# EAGLE design CUAVA_HSI_controller (EAGLE 9.5.2)

## Sheet 1 of 2: HSI Motherboard
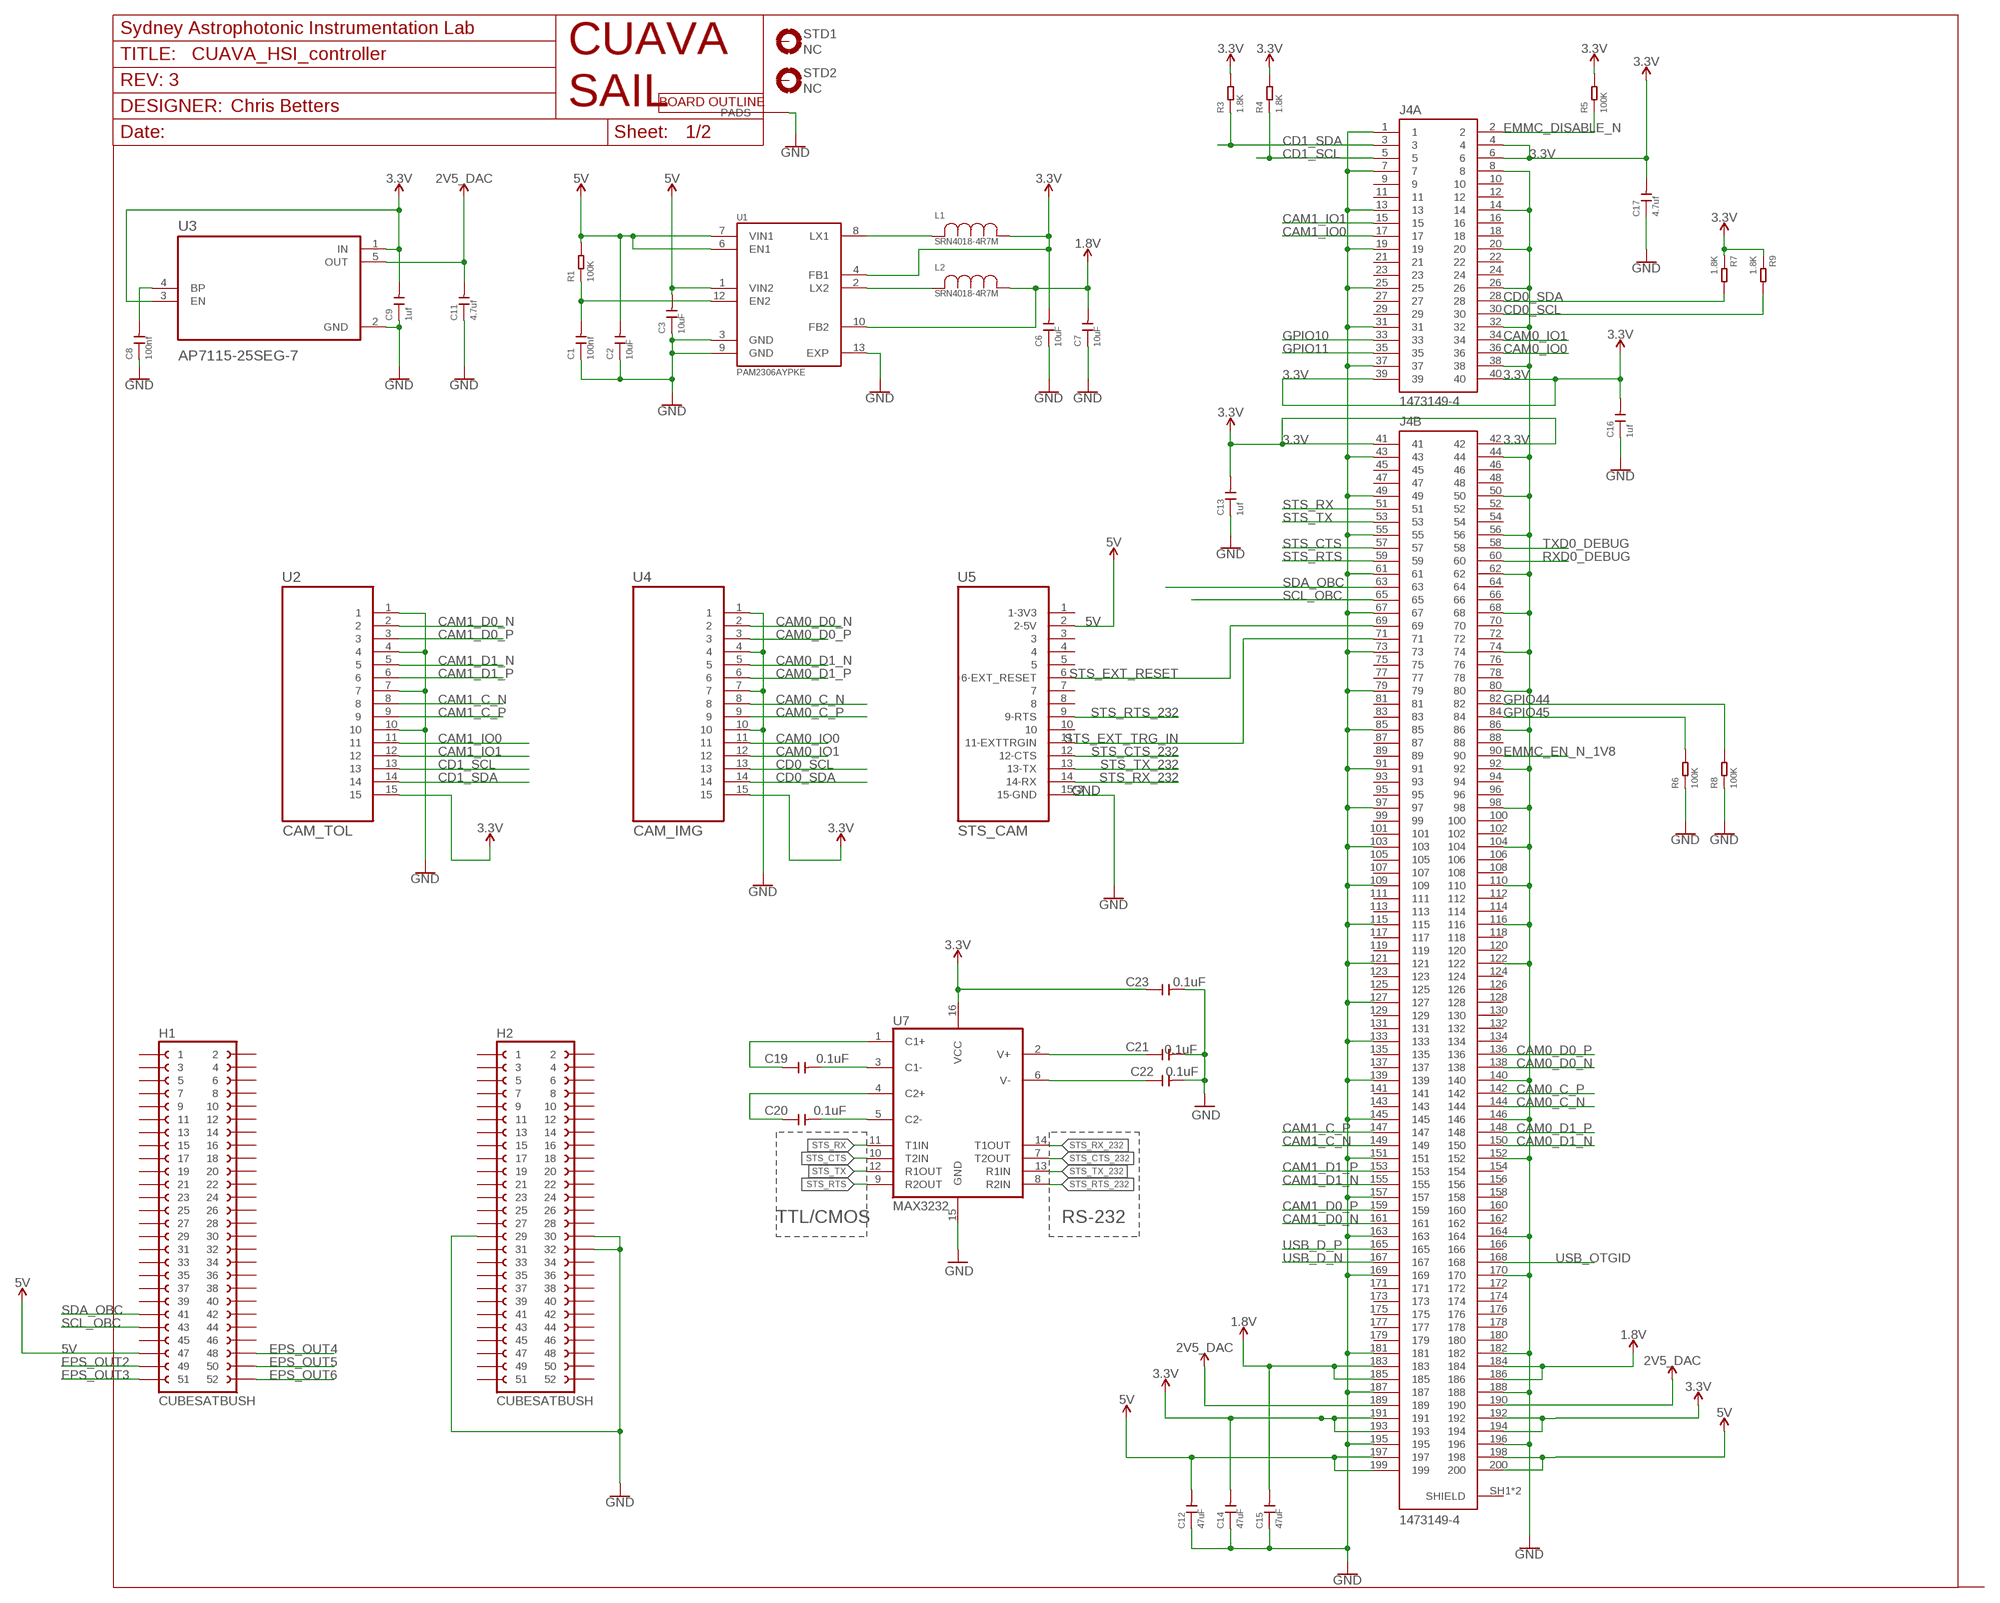
[diagram p0: schematic, sheet 1]

### Parts
C1  100nf  CERAMIC-100NF-25V-10%-X7R(0402)  [C0402K]
C2  10uF  CERAMIC-10UF-(1206)  [C3216]
C3  10uF  CERAMIC-10UF-(1206)  [C3216]
C6  10uF  CERAMIC-10UF-(1206)  [C3216]
C7  10uF  CERAMIC-10UF-(1206)  [C3216]
C8  100nf  CERAMIC-100NF-25V-10%-X7R(0402)  [C0402K]
C9  1uf  CERAMIC-1UF-10V-10%-X5R(0402)  [C0402K]
C11  4.7uf  CERAMIC-4.7UF-10V-10%-X5R(0603)  [C0603]
C12  47uF  CERAMIC-47UF-6.3V-20%-(1206)  [C3216]
C13  1uf  CERAMIC-1UF-10V-10%-X5R(0402)  [C0402K]
C14  47uF  CERAMIC-47UF-6.3V-20%-(1206)  [C3216]
C15  47uF  CERAMIC-47UF-6.3V-20%-(1206)  [C3216]
C16  1uf  CERAMIC-1UF-10V-10%-X5R(0402)  [C0402K]
C17  4.7uf  CERAMIC-4.7UF-10V-10%-X5R(0603)  [C0603]
C19  0.1uF  CERAMIC-0.1UF-16V-10%-X5R(0402)  [C0402K]
C20  0.1uF  CERAMIC-0.1UF-16V-10%-X5R(0402)  [C0402K]
C21  0.1uF  CERAMIC-0.1UF-16V-10%-X5R(0402)  [C0402K]
C22  0.1uF  CERAMIC-0.1UF-16V-10%-X5R(0402)  [C0402K]
C23  0.1uF  CERAMIC-0.1UF-16V-10%-X5R(0402)  [C0402K]
EDGE1  CUBESAT_BOARD_OUTLINE  [CUBESAT_BOARD_OUTLINE]
FRAME1  SAIL_FRAMEDEFAULT  [SAIL_FRAME_DEFAULT]
H1  CUBESATBUSH  [2X26HEADER]
H2  CUBESATBUSH  [2X26HEADER]
J4  1473149-4  [TE_1473149-4]
L1  SRN4018-4R7M  [IND_BOURNS_SRN4018]
L2  SRN4018-4R7M  [IND_BOURNS_SRN4018]
LOGO1  CUAVA_LOGO  [CUAVA_LOGO]
LOGO2  SAIL_LOGO  [SAIL_LOGO_VEC_20MM]
R1  100K  SMD-RES-100K-1%-1/16W(0402)  [R0402]
R3  1.8K  SMD-RES-1.8K-1%-1/16W(0402)  [R0402]
R4  1.8K  SMD-RES-1.8K-1%-1/16W(0402)  [R0402]
R5  100K  SMD-RES-100K-1%-1/16W(0402)  [R0402]
R6  100K  SMD-RES-100K-1%-1/16W(0402)  [R0402]
R7  1.8K  SMD-RES-1.8K-1%-1/16W(0402)  [R0402]
R8  100K  SMD-RES-100K-1%-1/16W(0402)  [R0402]
R9  1.8K  SMD-RES-1.8K-1%-1/16W(0402)  [R0402]
STD1  NC  9774030243  [3,0-PAD]
STD2  NC  9774030243  [3,0-PAD]
U1  PAM2306AYPKE  [SON45P300X300X80-13N]
U2  CAM_TOL  10051922-1510ELF  [FCI_10051922-1510ELF]
U3  AP7115-25SEG-7  [SOT65P210X110-5N]
U4  CAM_IMG  10051922-1510ELF  [FCI_10051922-1510ELF]
U5  STS_CAM  STS-10051922-1510ELF  [FCI_10051922-1510ELF]
U7  MAX3232  MAX232TSSOP  [TSSOP16]

### Nets
1.8V [pwr]: C7.2 C15.2 J4.183 J4.184 J4.185 J4.186 L2.1 U1.10(FB2)
2V5 [pwr]: C11.2 J4.189 J4.190 U3.5(OUT) ; supply symbol labelled 2V5_DAC
3.3V [pwr]: C6.2 C9.2 C13.2 C14.2 C16.2 C17.2 C23.1 J4.4 J4.6 J4.39 J4.40 J4.41 J4.42 J4.191 J4.192 J4.193 J4.194 L1.1 R3.2 R4.2 R5.2 R7.1 R9.1 U1.4(FB1) U2.15 U3.1(IN) U3.3(EN) U4.15 U7.16(VCC)
5V [pwr]: C2.2 C3.2 C12.2 H1.47 J4.197 J4.198 J4.199 J4.200 R1.2 U1.1(VIN2) U1.6(EN1) U1.7(VIN1) U5.2(2-5V) ; also sheet 2
C1+: C19.1 U7.1(C1+)
C1-: C19.2 U7.3(C1-)
C2+: C20.1 U7.4(C2+)
C2-: C20.2 U7.5(C2-)
CAM0_C_N [diff pairs]: J4.144 U4.8
CAM0_C_P [diff pairs]: J4.142 U4.9
CAM0_D0_N [diff pairs]: J4.138 U4.2
CAM0_D0_P [diff pairs]: J4.136 U4.3
CAM0_D1_N [diff pairs]: J4.150 U4.5
CAM0_D1_P [diff pairs]: J4.148 U4.6
CAM0_IO0: J4.36 U4.11
CAM0_IO1: J4.34 U4.12
CAM1_C_N [diff pairs]: J4.149 U2.8
CAM1_C_P [diff pairs]: J4.147 U2.9
CAM1_D0_N [diff pairs]: J4.161 U2.2
CAM1_D0_P [diff pairs]: J4.159 U2.3
CAM1_D1_N [diff pairs]: J4.155 U2.5
CAM1_D1_P [diff pairs]: J4.153 U2.6
CAM1_IO0: J4.17 U2.11
CAM1_IO1: J4.15 U2.12
CD0_SCL [i2c]: J4.30 R9.2 U4.13
CD0_SDA [i2c]: J4.28 R7.2 U4.14
CD1_SCL [i2c]: J4.5 R4.1 U2.13
CD1_SDA [i2c]: J4.3 R3.1 U2.14
EMMC_DISABLE_N: J4.2 R5.1
EMMC_EN_N_1V8: J4.90
EN2: C1.2 R1.1 U1.12(EN2)
EPS_OUT2 [pwr]: H1.49 ; also sheet 2
EPS_OUT3 [pwr]: H1.51
EPS_OUT4 [pwr]: H1.48 ; also sheet 2
EPS_OUT5 [pwr]: H1.50 ; also sheet 2
EPS_OUT6 [pwr]: H1.52 ; also sheet 2
GND [pwr]: C1.1 C2.1 C3.1 C6.1 C7.1 C8.1 C9.1 C11.1 C12.1 C13.1 C14.1 C15.1 C16.1 C17.1 C21.2 C22.2 C23.2 EDGE1.P$1(PADS) EDGE1.P$2(PADS) EDGE1.P$3(PADS) EDGE1.P$4(PADS) H2.29 H2.30 H2.32 J4.1 J4.7 J4.8 J4.13 J4.14 J4.19 J4.20 J4.25 J4.26 J4.31 J4.32 J4.37 J4.38 J4.43 J4.44 J4.49 J4.50 J4.55 J4.56 J4.61 J4.62 J4.67 J4.68 J4.73 J4.74 J4.79 J4.80 J4.85 J4.86 J4.91 J4.92 J4.97 J4.98 J4.103 J4.104 J4.109 J4.110 J4.115 J4.116 J4.121 J4.122 J4.127 J4.133 J4.139 J4.140 J4.145 J4.146 J4.151 J4.152 J4.157 J4.163 J4.164 J4.169 J4.170 J4.181 J4.182 J4.187 J4.188 J4.195 J4.196 R6.1 R8.1 U1.3(GND) U1.9(GND) U1.13(EXP) U2.1 U2.4 U2.7 U2.10 U3.2(GND) U4.1 U4.4 U4.7 U4.10 U5.15(15-GND) U5.16(15-GND) U5.17(15-GND) U7.15(GND) ; also sheet 2
GPIO10: J4.33
GPIO11: J4.35
GPIO44: J4.82 R8.2
GPIO45: J4.84 R6.2
LX1: L1.2 U1.8(LX1)
LX2: L2.2 U1.2(LX2)
N$6: C8.2 U3.4(BP)
RXD0_DEBUG: J4.60 ; also sheet 2
SCL_OBC [i2c]: H1.43 J4.65 ; also sheet 2
SDA_OBC [i2c]: H1.41 J4.63 ; also sheet 2
STS_CTS: J4.57 U7.10(T2IN)
STS_CTS_232: U5.12(12-CTS) U7.7(T2OUT)
STS_EXT_RESET: J4.69 U5.6(6-EXT_RESET)
STS_EXT_TRG_IN: J4.71 U5.11(11-EXTTRGIN)
STS_RTS: J4.59 U7.9(R2OUT)
STS_RTS_232: U5.9(9-RTS) U7.8(R2IN)
STS_RX: J4.51 U7.11(T1IN)
STS_RX_232: U5.14(14-RX) U7.14(T1OUT)
STS_TX: J4.53 U7.12(R1OUT)
STS_TX_232: U5.13(13-TX) U7.13(R1IN)
TXD0_DEBUG: J4.58 ; also sheet 2
USB_D_N [usb]: J4.167 ; also sheet 2
USB_D_P [usb]: J4.165 ; also sheet 2
USB_OTGID: J4.168
V+: C21.1 U7.2(V+)
V-: C22.1 U7.6(V-)
Unconnected: H1.1 H1.2 H1.3 H1.4 H1.5 H1.6 H1.7 H1.8 H1.9 H1.10 H1.11 H1.12 H1.13 H1.14 H1.15 H1.16 H1.17 H1.18 H1.19 H1.20 H1.21 H1.22 H1.23 H1.24 H1.25 H1.26 H1.27 H1.28 H1.29 H1.30 H1.31 H1.32 H1.33 H1.34 H1.35 H1.36 H1.37 H1.38 H1.39 H1.40 H1.42 H1.44 H1.45 H1.46 H2.1 H2.2 H2.3 H2.4 H2.5 H2.6 H2.7 H2.8 H2.9 H2.10 H2.11 H2.12 H2.13 H2.14 H2.15 H2.16 H2.17 H2.18 H2.19 H2.20 H2.21 H2.22 H2.23 H2.24 H2.25 H2.26 H2.27 H2.28 H2.31 H2.33 H2.34 H2.35 H2.36 H2.37 H2.38 H2.39 H2.40 H2.41 H2.42 H2.43 H2.44 H2.45 H2.46 H2.47 H2.48 H2.49 H2.50 H2.51 H2.52 J4.9 J4.10 J4.11 J4.12 J4.16 J4.18 J4.21 J4.22 J4.23 J4.24 J4.27 J4.29 J4.45 J4.46 J4.47 J4.48 J4.52 J4.54 J4.64 J4.66 J4.70 J4.72 J4.75 J4.76 J4.77 J4.78 J4.81 J4.83 J4.87 J4.88 J4.89 J4.93 J4.94 J4.95 J4.96 J4.99 J4.100 J4.101 J4.102 J4.105 J4.106 J4.107 J4.108 J4.111 J4.112 J4.113 J4.114 J4.117 J4.118 J4.119 J4.120 J4.123 J4.124 J4.125 J4.126 J4.128 J4.129 J4.130 J4.131 J4.132 J4.134 J4.135 J4.137 J4.141 J4.143 J4.154 J4.156 J4.158 J4.160 J4.162 J4.166 J4.171 J4.172 J4.173 J4.174 J4.175 J4.176 J4.177 J4.178 J4.179 J4.180 J4.SH1(B:SHIELD) J4.SH2(B:SHIELD) STD1.B3,0(MOUNT) STD2.B3,0(MOUNT) U5.1(1-3V3) U5.3 U5.4 U5.5 U5.7 U5.8 U5.10

### Notes on the sheet
- TTL/CMOS | RS-232

## Sheet 2 of 2: Power Breakouts from PC/104 header to other systems.
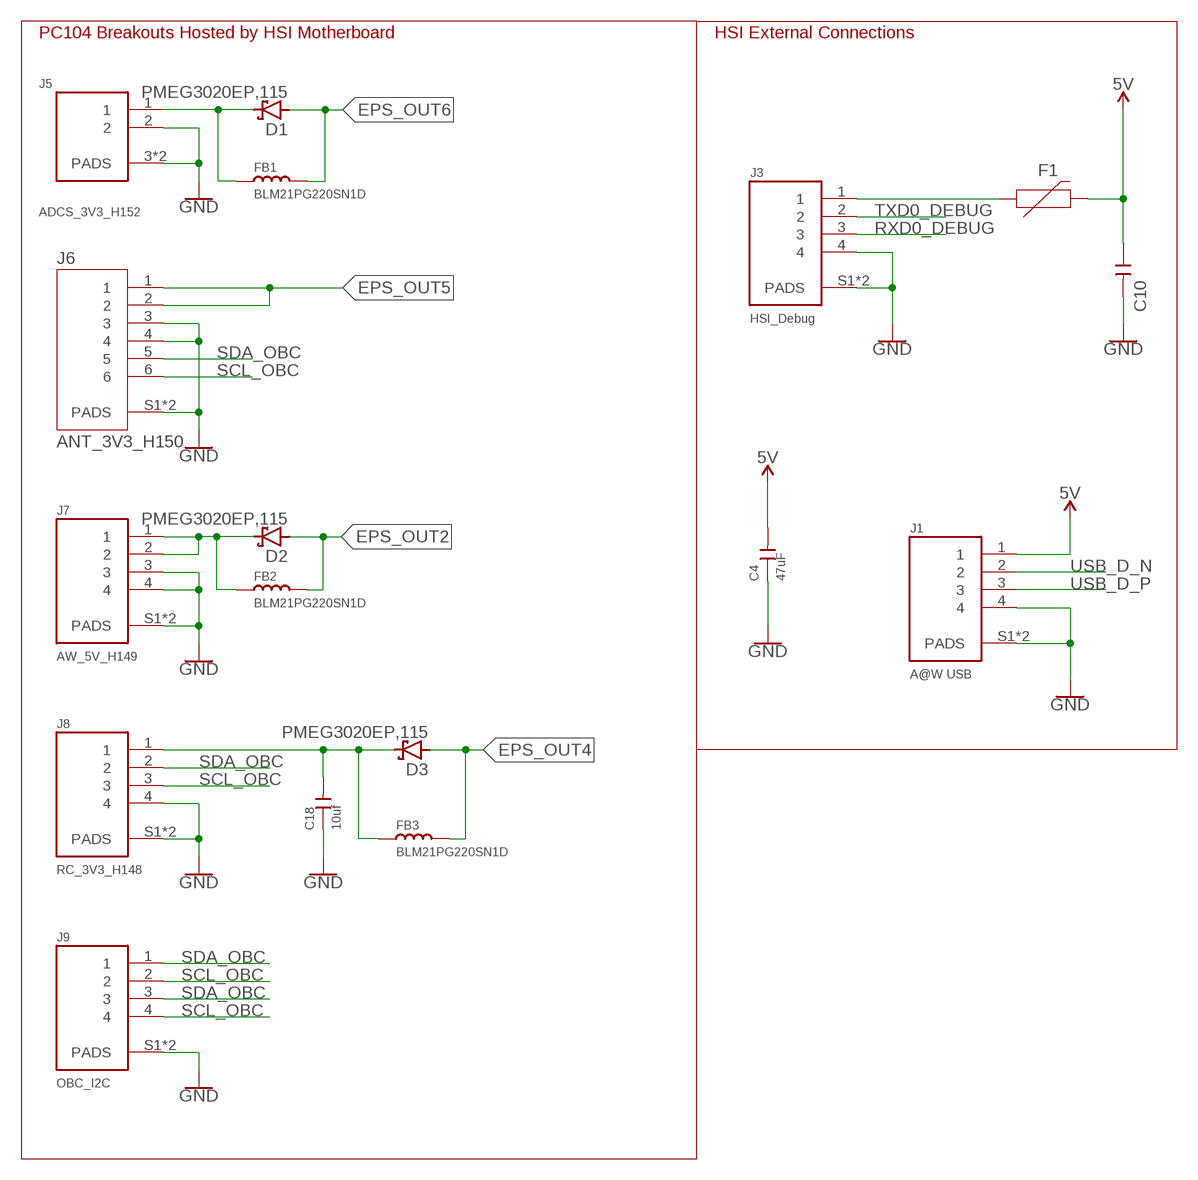
[diagram p1: schematic, sheet 2]

### Parts
C4  47uF  CERAMIC-47UF-6.3V-20%-(1206)  [C3216]
C10  47uF  CERAMIC-47UF-6.3V-20%-(1206)  [C3216]
C18  10uf  TANTALUM-10UF-10V-10%(0805)  [C2012]
D1  PMEG3020EP,115  [SODFL4725X110N]
D2  PMEG3020EP,115  [SODFL4725X110N]
D3  PMEG3020EP,115  [SODFL4725X110N]
F1  MF-MSMF200-2  [FUSM4632X85]
FB1  BLM21PG220SN1D  [C0805]
FB2  BLM21PG220SN1D  [C0805]
FB3  BLM21PG220SN1D  [C0805]
J1  A@W USB  PICOBLADE-4PIN-RIGHTANGLE-SMD  [MOLEX_0532610471]
J3  HSI_Debug  PICOBLADE-4PIN-RIGHTANGLE-SMD  [MOLEX_0532610471]
J5  ADCS_3V3_H152  PICOBLADE-2PIN-RIGHTANGLE-SMD  [MOLEX_0532610271]
J6  ANT_3V3_H150  PICOBLADE-6PIN-RIGHTANGLE-SMD  [MOLEX_0532610671]
J7  AW_5V_H149  PICOBLADE-4PIN-RIGHTANGLE-SMD  [MOLEX_0532610471]
J8  RC_3V3_H148  PICOBLADE-4PIN-RIGHTANGLE-SMD  [MOLEX_0532610471]
J9  OBC_I2C  PICOBLADE-4PIN-RIGHTANGLE-SMD  [MOLEX_0532610471]

### Nets
5V [pwr]: C4.2 C10.1 F1.2 J1.1 ; also sheet 1
A@W_5V0 [pwr]: D2.C FB2.1 J7.1 J7.2
ADCS_3V3 [pwr]: D1.C FB1.1 J5.1
EPS_OUT2 [pwr]: D2.A FB2.2 ; also sheet 1
EPS_OUT4 [pwr]: D3.A FB3.2 ; also sheet 1
EPS_OUT5 [pwr]: J6.1 J6.2 ; also sheet 1
EPS_OUT6 [pwr]: D1.A FB1.2 ; also sheet 1
GND [pwr]: C4.1 C10.2 C18.1 J1.4 J1.S1(PADS) J1.S2(PADS) J3.4 J3.S1(PADS) J3.S2(PADS) J5.2 J5.3(PADS) J5.4(PADS) J6.3 J6.4 J6.S1(PADS) J6.S2(PADS) J7.3 J7.4 J7.S1(PADS) J7.S2(PADS) J8.4 J8.S1(PADS) J8.S2(PADS) J9.S1(PADS) J9.S2(PADS) ; also sheet 1
HSI_DEBUG_V [pwr]: F1.1 J3.1
RC_3V3 [pwr]: C18.2 D3.C FB3.1 J8.1
RXD0_DEBUG: J3.3 ; also sheet 1
SCL_OBC [i2c]: J6.6 J8.3 J9.2 J9.4 ; also sheet 1
SDA_OBC [i2c]: J6.5 J8.2 J9.1 J9.3 ; also sheet 1
TXD0_DEBUG: J3.2 ; also sheet 1
USB_D_N [usb]: J1.2 ; also sheet 1
USB_D_P [usb]: J1.3 ; also sheet 1

### Notes on the sheet
- PC104 Breakouts Hosted by HSI Motherboard | HSI External Connections

## Library data of the parts
C1 C8 = RPI_CAM:CERAMIC-100NF-25V-10%-X7R(0402): 302010024; MPN: CC0402KRX7R8BB104
C2 C3 C6 C7 = RPI_CAM:CERAMIC-10UF-(1206); MPN: MF-CAP-1206-10uF
C4 C10 C12 C14 C15 = RPI_CAM:CERAMIC-47UF-6.3V-20%-(1206): CC1206MKX5R5BB476 - SEEEDOPL 1206 47UF ±20% 6.3V X5R GRM31CE70J476ME15L (https://www.digikey.com.au/product-detail/en/murata-electronics-north-america/GRM31CE70J476ME15L/490-9967-1-ND/5026463) - better temp Current Samsung CL31A476MQHNNNE; MPN: CL31A476MQHNNNE
C9 C13 C16 = RPI_CAM:CERAMIC-1UF-10V-10%-X5R(0402): 302010040; MPN: MF-CAP-0402-1uF; MPN_SEEED: CC0402KRX5R6BB105
C11 C17 = RPI_CAM:CERAMIC-4.7UF-10V-10%-X5R(0603): SEEDOPL - CCC0603KRX5R6BB475 Current Samsung CL10A475KQ8NNNC; MPN: CL10A475KQ8NNN
C18 = RPI_CAM:TANTALUM-10UF-10V-10%(0805): Tantalum Capacitors - Solid SMD 10V 10uF 10%; MPN: TAJP106K010RNJ
C19-C23 = RPI_CAM:CERAMIC-0.1UF-16V-10%-X5R(0402): 302010040; MPN: MF-CAP-0402-0.1uF; SPARKLE_ID: 918
D1-D3 = RPI_CAM:PMEG3020EP,115: PMEG3020 Series 30 V 2 A Low VF MEGA Schottky Barrier Rectifier - SOD-128; MPN: PMEG3020EP,115
EDGE1 = RPI_CAM:CUBESAT_BOARD_OUTLINE
F1 = RPI_CAM:MF-MSMF200-2: PTC Resettable Fuse 0.5A(hold) 1A(trip) 15V 100A 0.8W 0.15s 0.15Ohm SMD Solder Pad 1812 T/; MPN: MF-MSMF200-2
FB1-FB3 = RPI_CAM:BLM21PG220SN1D: BLM Series 0805 22 Ohm 6000 mA 0.01 DCR Surface Mount Ferrite Bead; MPN: no place BLM21PG220SN1D
FRAME1 = RPI_CAM:SAIL_FRAME: Library: MF_Aesthetics Description: Frame for adding Meta Data to the PCB and Schematic.; DNAME: Chris Betters; HOUSEPART: 0; POPULATE: 0; REVNUM: REV: 3
H1 H2 = RPI_CAM:CUBESATBUS: Cubesat Kit connector (CSKB) ESQ-126-39-G-D or ESQ-126-38-G-D or SSQ-126-21-G-D or TSW-126-07-G-D (Female part of the connector is on top of the board); MPN: TSW-126-07-G-D
J1 J3 J7-J9 = RPI_CAM:PICOBLADE-4PIN-RIGHTANGLE-SMD: Conn Shrouded Header HDR 4 POS 1.25mm Solder RA SMD PicoBlade™ Embossed T/R; AVAILABILITY: Unavailable; DESCRIPTION: Conn Shrouded Header HDR 4 POS 1.25mm Solder RA SMD PicoBlade™ Embossed T/R; MF: Molex; MPN: 0532610471; PACKAGE: None; PRICE: None
J4 = RPI_CAM:1473149-4: CONN SKT SODIMM 200POS R/A SMD; AVAILABILITY: Good; CENTERLINE_PITCH: .6 mm[.024 in]; COMMENT: 1473149-4; DESCRIPTION: SEMI-HARD TRAY ASSY DDDR2 SODIMM 5.2H ST; MF: TE Connectivity; MPN: 1473149-4; NUMBER_OF_POSITIONS: 200; PACKAGE: None; PRICE: 2.17 USD; PRODUCT_TYPE: Socket
J5 = RPI_CAM:PICOBLADE-2PIN-RIGHTANGLE-SMD: 1.25mm (.049") Pitch PicoBlade Header, Surface Mount, Right Angle, Lead-free, 2 Circuits; AVAILABILITY: Unavailable; DESCRIPTION: 1.25mm _.049_ Pitch PicoBlade Header, Surface Mount, Right Angle, Lead-free, 2 Circuits; MF: Molex; MPN: 0532610271; PACKAGE: None; PRICE: None
J6 = RPI_CAM:PICOBLADE-6PIN-RIGHTANGLE-SMD: 1.25mm Pitch PicoBlade™ Header, Surface Mount, Right Angle, 6 Circuits; AVAILABILITY: Unavailable; DESCRIPTION: 1.25mm _.049_ Pitch PicoBlade Header, Surface Mount, Right Angle, Lead-free, 6 Circuits; MF: Molex; MPN: 0532610671; PACKAGE: None; PRICE: None
L1 L2 = RPI_CAM:SRN4018-4R7M: SRN4018-4R7M Inductor; Semi-Shielded; Ind 4.7 uH; Tol 20%; Cur-Rtg 1.9 A; SMT; 1616; MPN: SRN40184R7M; VENDOR: Bourns Electronics
LOGO1 = RPI_CAM:CUAVA_LOGO
LOGO2 = RPI_CAM:SAIL_LOGO
R1 R5 R6 R8 = RPI_CAM:SMD-RES-100K-1%-1/16W(0402): 301010456; MPN: MF-RES-0402-100K; MPN_SEEED: RC0402FR-07100KL
R3 R4 R7 R9 = RPI_CAM:SMD-RES-1.8K-1%-1/16W(0402): 301010057; MPN: RC0402FR-071K8L
STD1 STD2 = RPI_CAM:9774030243: Standoffs & Spacers WA-SMSI SMT Steel M2 Intrnl NonStop https://katalog.we-online.de/em/datasheet/9774030243.pdf; MPN: 9774030243R
U1 = RPI_CAM:PAM2306AYPKE: PAM2306 Series 5.5V 1A Dual High Efficiency PWM Step Down DC-DC Converter-WDFN12; AVAILABILITY: Good; DESCRIPTION: PAM2306 Series 1.8V/3.3V 1 A Dual High Efficiency PWM Step Down DC-DC Conveter; MF: Diodes Inc.; MPN: PAM2306AYPKE; PACKAGE: WFDFN-12 Diodes Inc.; PRICE: 0.44 USD
U2 U4 = RPI_CAM:10051922-1510ELF: FFC/FPC CONNECTOR, 15POS, 1ROW; AVAILABILITY: Good; DESCRIPTION: Conn; Rect; FPC/FFC; ZIF; 15Cnts; SMT; VLL Series; 0.5mmPinSpng; RtAng; LowerSideContact; MF: FCI; MPN: 10051922-1510ELF; PACKAGE: None; PRICE: 0.44 USD
U3 = RPI_CAM:AP7115-25SEG-7: LDO Voltage Regulators LDO SNGLE OUTPUT 150MA 220MV 2.5V; AVAILABILITY: Good; DESCRIPTION: LDO Regulator Pos 2.5V 0.15A 5-Pin SOT-353 T/R; MF: Diodes Inc.; MPN: AP7115-25SEG-7; PACKAGE: SOT-353 Diodes Inc.; PRICE: 0.15 USD
U5 = RPI_CAM:STS-10051922-1510ELF: FFC/FPC CONNECTOR, 15POS, 1ROW; AVAILABILITY: Good; DESCRIPTION: Conn; Rect; FPC/FFC; ZIF; 15Cnts; SMT; VLL Series; 0.5mmPinSpng; RtAng; LowerSideContact; MF: FCI; MPN: 10051922-1510ELF; PACKAGE: None; PRICE: 0.44 USD
U7 = RPI_CAM:MAX232: RS232 Transceiver Very common IC. This is generically called 'MAX232', but works with the 3V equivalent MAX3232 generic ICs. Field tested and mother approved. Spark Fun Electronics SKU : COM-00316 (DIP) and COM-00589 (SMD); MPN: MAX3232EEUE; PROD_ID: IC-08171

## Net classes
0 default: width 0.152 mm
1 diff pairs: width 0.203 mm, clearance 0.152 mm
2 pwr: width 0.254 mm, clearance 0.152 mm to class 0, clearance 0.152 mm
3 usb: width 0.254 mm, clearance 0.152 mm

## Board
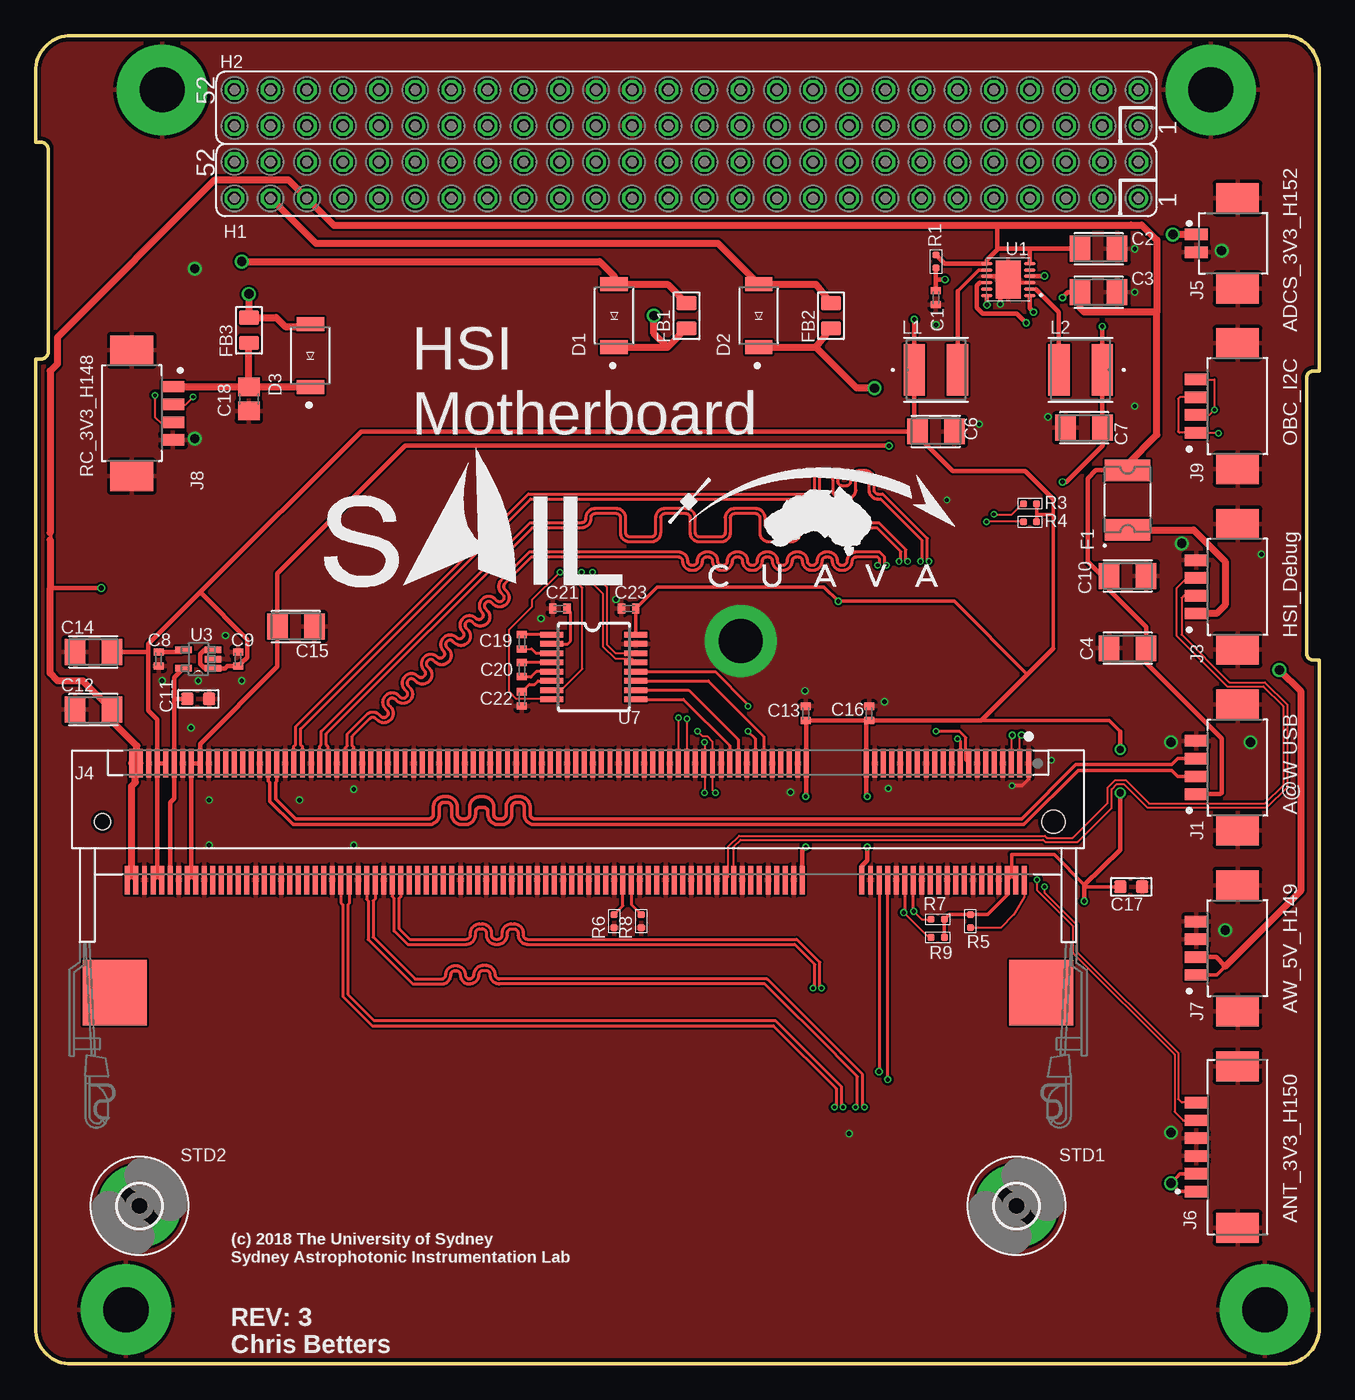
[diagram p2: board, top side]
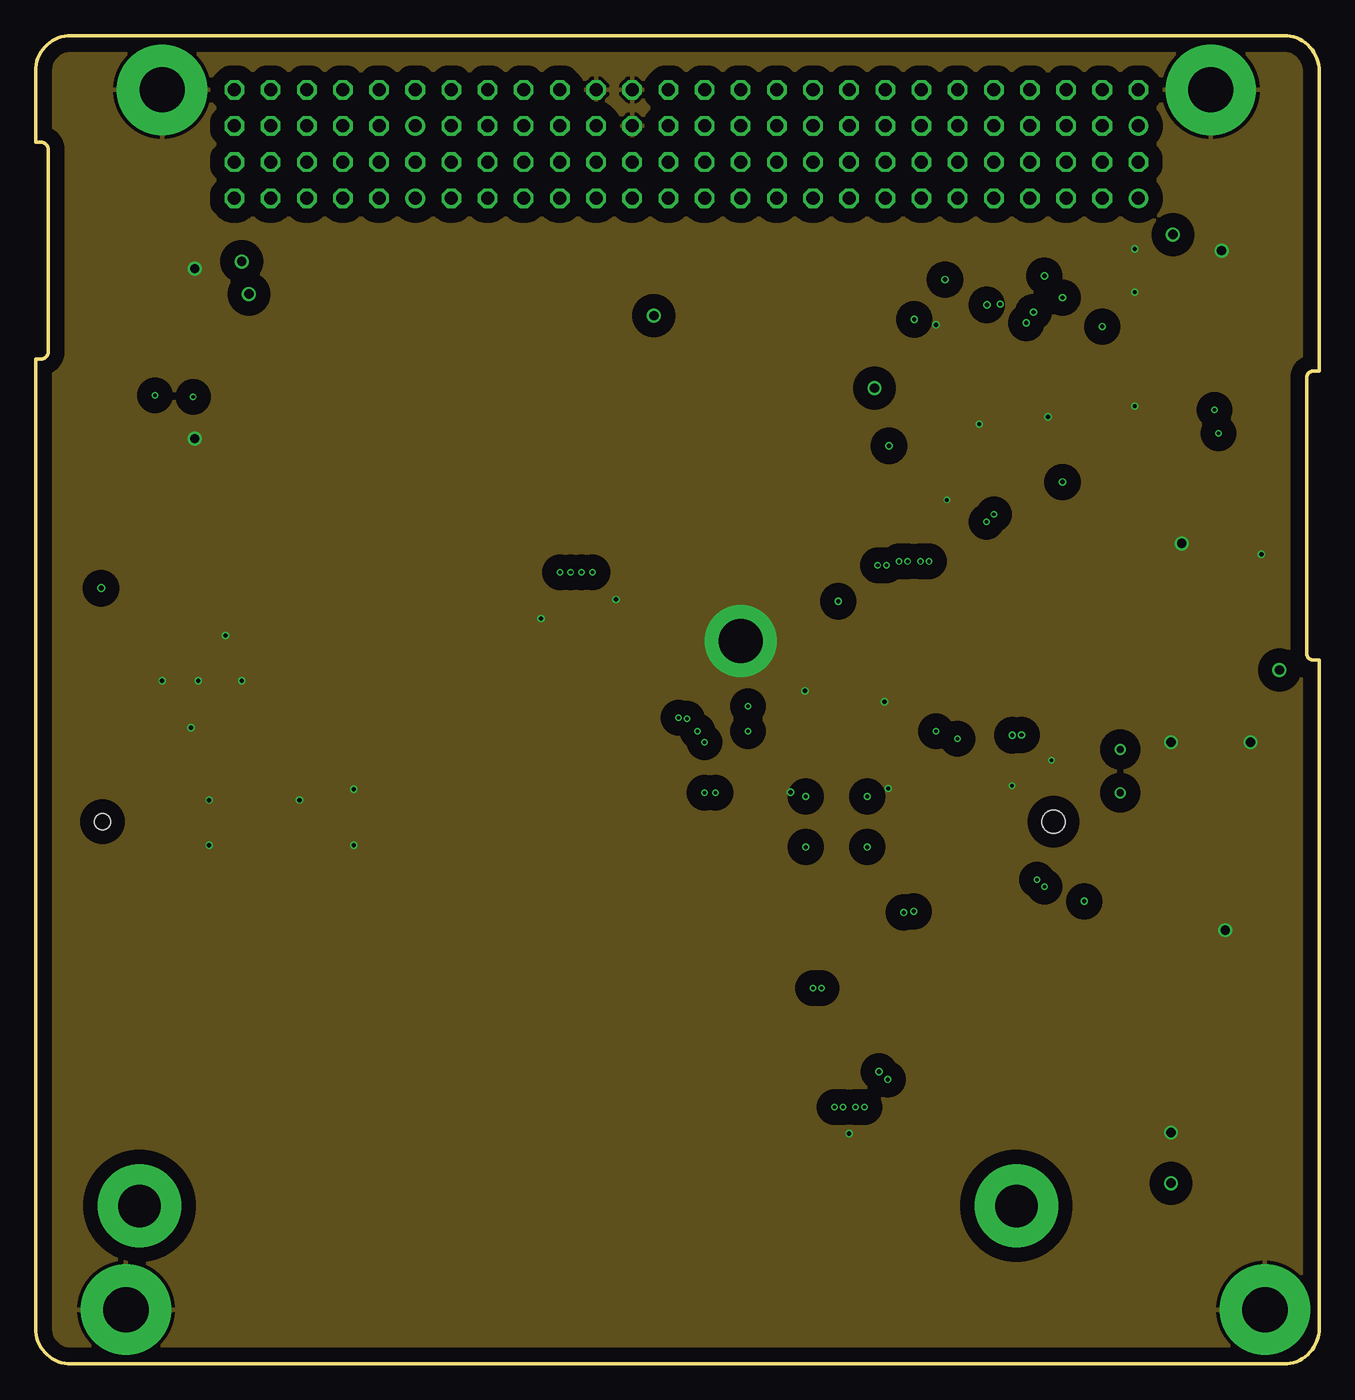
[diagram p3: board, inner layer Route2]
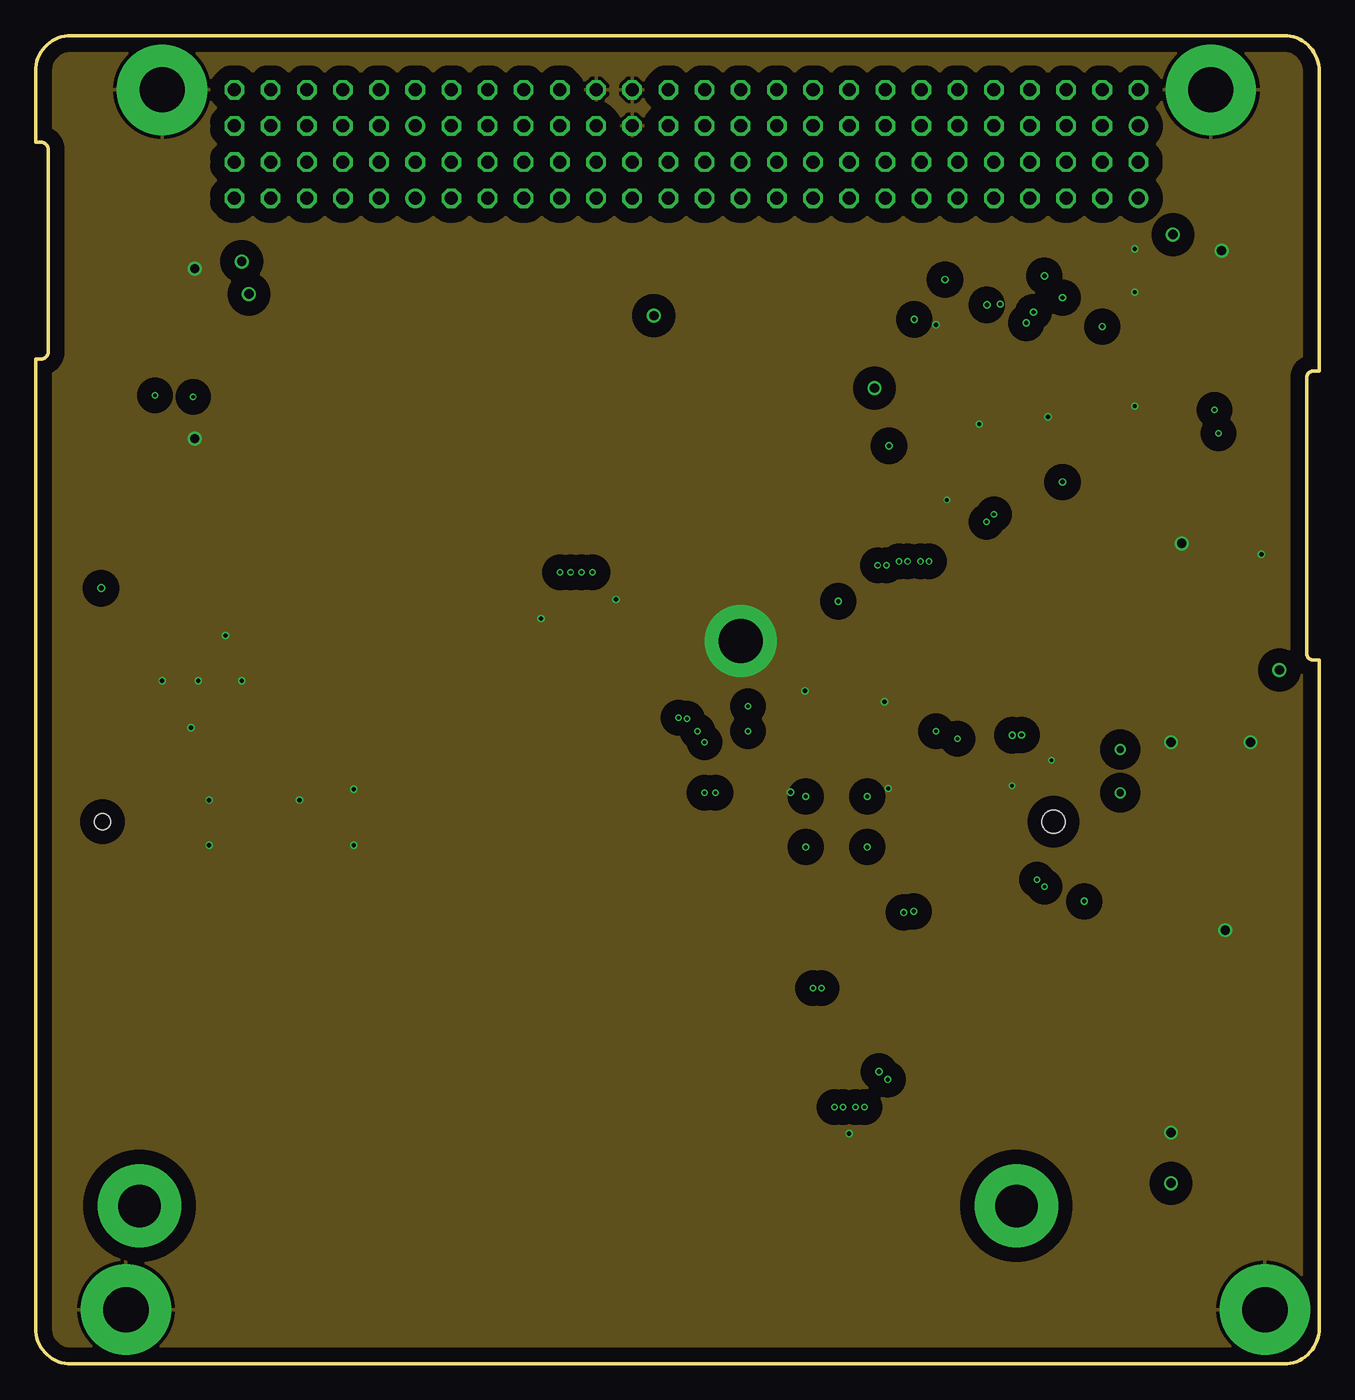
[diagram p4: board, inner layer Route15]
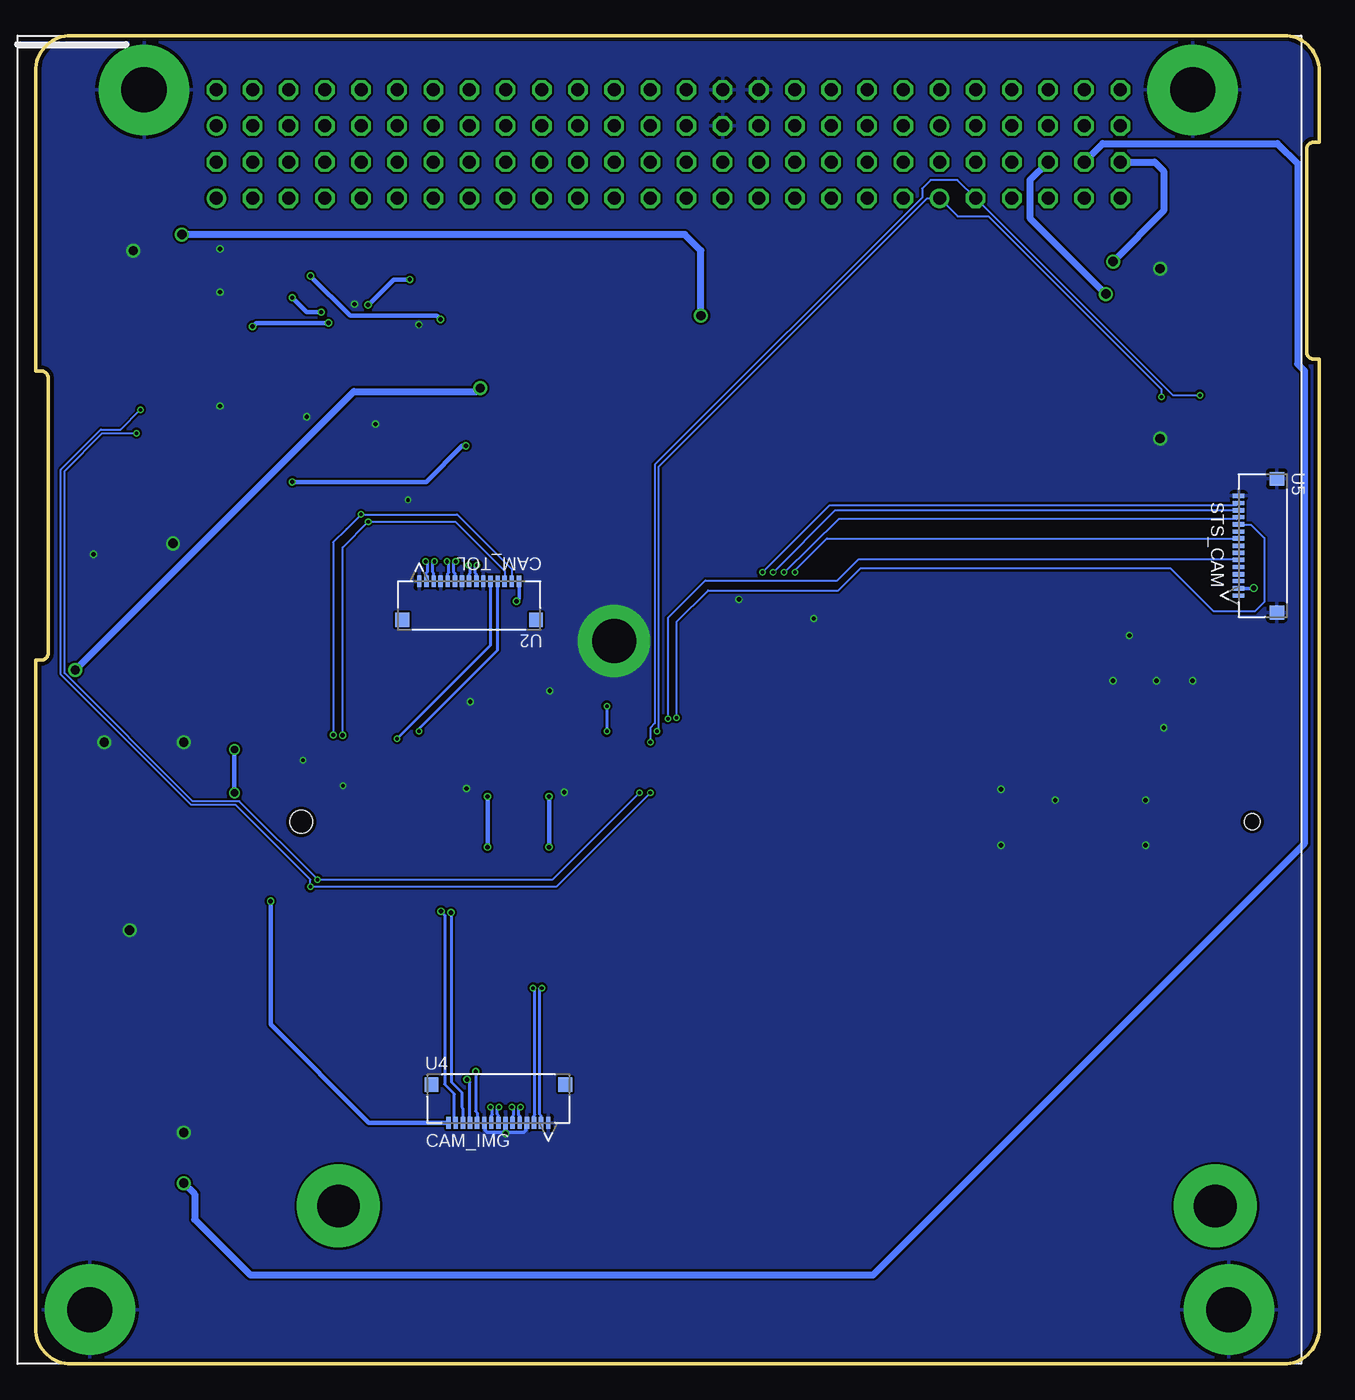
[diagram p5: board, bottom side, seen from below]

Size 90.17 x 93.34 mm. Coordinates in mm from the lower left corner, seen from the top.
Outline: 90.17,49.45 90.17,2.49 arc-90 87.68,0 2.49,0 arc-90 0,2.49 0,70.61 0.39,70.61 arc90 0.89,71.11 0.89,85.35 arc90 0.39,85.85 0,85.85 0,90.86 arc-90 2.49,93.34 87.68,93.34 arc-90 90.17,90.86 90.17,69.77 89.78,69.77 arc90 89.28,69.27 89.28,49.95 arc90 89.78,49.45 90.17,49.45
Copper layers (1*2*15*16): Top 0.035mm / dielectric 0.23mm / Route2 0.035mm / dielectric 0.93mm / Route15 0.035mm / dielectric 0.23mm / Bottom 0.035mm
Design rules "MF_Standard_4_Layer": minimum track width 5mil, minimum drill 10mil, track to track 5mil, track to pad 5mil, pad to pad 5mil, via to via 5mil, smd to smd 0mil, copper to edge 10mil, drill to drill 10mil, minimum pad ring 4mil, minimum via ring 4mil, stop-mask expansion 2mil, vias tented up to drill 25mil, thermal gap 10mil

### Footprints (pad centres in the part's own frame; a part is rotated, then mirrored left to right if it is on the bottom)
C0402K = smd 0.5 x 0.7: 1 -0.5,0; 2 0.5,0
C3216 = smd 1.44 x 1.82: 1 -1.295,0; 2 1.295,0
C0603 = smd 0.889 x 0.889: 1 -0.762,0; 2 0.762,0
C2012 = smd 1.3 x 1.5: 1 -0.85,0; 2 0.85,0
SODFL4725X110N = smd 0.99 x 1.92: A 2.21,0; C -2.21,0
CUBESAT_BOARD_OUTLINE = drill 3.175 pad 6.35: P$1 5.08,3.81; P$2 85.09,3.81; P$3 82.55,89.535; P$4 8.89,89.535
FUSM4632X85 = smd 1.5 x 3.2: 1 -2.1,0; 2 2.1,0
C0805 = smd 1.397 x 1.016: 1 0,0.889; 2 0,-0.889
2X26HEADER = drill 0.914: 1 63.5,0; 41 12.7,0 | drill 0.914 octagon: 2 63.5,2.54; 3 60.96,0; 4 60.96,2.54; 5 58.42,0; 6 58.42,2.54; 7 55.88,0; 8 55.88,2.54; 9 53.34,0; 10 53.34,2.54; 11 50.8,0; 12 50.8,2.54; 13 48.26,0; 14 48.26,2.54; 15 45.72,0; 16 45.72,2.54; 17 43.18,0; 18 43.18,2.54; 19 40.64,0; 20 40.64,2.54; 21 38.1,0; 22 38.1,2.54; 23 35.56,0; 24 35.56,2.54; 25 33.02,0; 26 33.02,2.54; 27 30.48,0; 28 30.48,2.54; 29 27.94,0; 30 27.94,2.54; 31 25.4,0; 32 25.4,2.54; 33 22.86,0; 34 22.86,2.54; 35 20.32,0; 36 20.32,2.54; 37 17.78,0; 38 17.78,2.54; 39 15.24,0; 40 15.24,2.54; 42 12.7,2.54; 43 10.16,0; 44 10.16,2.54; 45 7.62,0; 46 7.62,2.54; 47 5.08,0; 48 5.08,2.54; 49 2.54,0; 50 2.54,2.54; 51 0,0; 52 0,2.54
MOLEX_0532610471 = smd 0.8 x 1.6: 1 -1.875,0; 2 -0.625,0; 3 0.625,0; 4 1.875,0 | smd 2.1 x 3: S1 -4.425,-2.9; S2 4.425,-2.9
TE_1473149-4 = smd 0.35 x 2: 1 31.65,4.1; 2 31.35,-4.1; 3 31.05,4.1; 4 30.75,-4.1; 5 30.45,4.1; 6 30.15,-4.1; 7 29.85,4.1; 8 29.55,-4.1; 9 29.25,4.1; 10 28.95,-4.1; 11 28.65,4.1; 12 28.35,-4.1; 13 28.05,4.1; 14 27.75,-4.1; 15 27.45,4.1; 16 27.15,-4.1; 17 26.85,4.1; 18 26.55,-4.1; 19 26.25,4.1; 20 25.95,-4.1; 21 25.65,4.1; 22 25.35,-4.1; 23 25.05,4.1; 24 24.75,-4.1; 25 24.45,4.1; 26 24.15,-4.1; 27 23.85,4.1; 28 23.55,-4.1; 29 23.25,4.1; 30 22.95,-4.1; 31 22.65,4.1; 32 22.35,-4.1; 33 22.05,4.1; 34 21.75,-4.1; 35 21.45,4.1; 36 21.15,-4.1; 37 20.85,4.1; 38 20.55,-4.1; 39 20.25,4.1; 40 19.95,-4.1; 41 16.05,4.1; 42 15.75,-4.1; 43 15.45,4.1; 44 15.15,-4.1; 45 14.85,4.1; 46 14.55,-4.1; 47 14.25,4.1; 48 13.95,-4.1; 49 13.65,4.1; 50 13.35,-4.1; 51 13.05,4.1; 52 12.75,-4.1; 53 12.45,4.1; 54 12.15,-4.1; 55 11.85,4.1; 56 11.55,-4.1; 57 11.25,4.1; 58 10.95,-4.1; 59 10.65,4.1; 60 10.35,-4.1; 61 10.05,4.1; 62 9.75,-4.1; 63 9.45,4.1; 64 9.15,-4.1; 65 8.85,4.1; 66 8.55,-4.1; 67 8.25,4.1; 68 7.95,-4.1; 69 7.65,4.1; 70 7.35,-4.1; 71 7.05,4.1; 72 6.75,-4.1; 73 6.45,4.1; 74 6.15,-4.1; 75 5.85,4.1; 76 5.55,-4.1; 77 5.25,4.1; 78 4.95,-4.1; 79 4.65,4.1; 80 4.35,-4.1; 81 4.05,4.1; 82 3.75,-4.1; 83 3.45,4.1; 84 3.15,-4.1; 85 2.85,4.1; 86 2.55,-4.1; 87 2.25,4.1; 88 1.95,-4.1; 89 1.65,4.1; 90 1.35,-4.1; 91 1.05,4.1; 92 0.75,-4.1; 93 0.45,4.1; 94 0.15,-4.1; 95 -0.15,4.1; 96 -0.45,-4.1; 97 -0.75,4.1; 98 -1.05,-4.1; 99 -1.35,4.1; 100 -1.65,-4.1; 101 -1.95,4.1; 102 -2.25,-4.1; 103 -2.55,4.1; 104 -2.85,-4.1; 105 -3.15,4.1; 106 -3.45,-4.1; 107 -3.75,4.1; 108 -4.05,-4.1; 109 -4.35,4.1; 110 -4.65,-4.1; 111 -4.95,4.1; 112 -5.25,-4.1; 113 -5.55,4.1; 114 -5.85,-4.1; 115 -6.15,4.1; 116 -6.45,-4.1; 117 -6.75,4.1; 118 -7.05,-4.1; 119 -7.35,4.1; 120 -7.65,-4.1; 121 -7.95,4.1; 122 -8.25,-4.1; 123 -8.55,4.1; 124 -8.85,-4.1; 125 -9.15,4.1; 126 -9.45,-4.1; 127 -9.75,4.1; 128 -10.05,-4.1; 129 -10.35,4.1; 130 -10.65,-4.1; 131 -10.95,4.1; 132 -11.25,-4.1; 133 -11.55,4.1; 134 -11.85,-4.1; 135 -12.15,4.1; 136 -12.45,-4.1; 137 -12.75,4.1; 138 -13.05,-4.1; 139 -13.35,4.1; 140 -13.65,-4.1; 141 -13.95,4.1; 142 -14.25,-4.1; 143 -14.55,4.1; 144 -14.85,-4.1; 145 -15.15,4.1; 146 -15.45,-4.1; 147 -15.75,4.1; 148 -16.05,-4.1; 149 -16.35,4.1; 150 -16.65,-4.1; 151 -16.95,4.1; 152 -17.25,-4.1; 153 -17.55,4.1; 154 -17.85,-4.1; 155 -18.15,4.1; 156 -18.45,-4.1; 157 -18.75,4.1; 158 -19.05,-4.1; 159 -19.35,4.1; 160 -19.65,-4.1; 161 -19.95,4.1; 162 -20.25,-4.1; 163 -20.55,4.1; 164 -20.85,-4.1; 165 -21.15,4.1; 166 -21.45,-4.1; 167 -21.75,4.1; 168 -22.05,-4.1; 169 -22.35,4.1; 170 -22.65,-4.1; 171 -22.95,4.1; 172 -23.25,-4.1; 173 -23.55,4.1; 174 -23.85,-4.1; 175 -24.15,4.1; 176 -24.45,-4.1; 177 -24.75,4.1; 178 -25.05,-4.1; 179 -25.35,4.1; 180 -25.65,-4.1; 181 -25.95,4.1; 182 -26.25,-4.1; 183 -26.55,4.1; 184 -26.85,-4.1; 185 -27.15,4.1; 186 -27.45,-4.1; 187 -27.75,4.1; 188 -28.05,-4.1; 189 -28.35,4.1; 190 -28.65,-4.1; 191 -28.95,4.1; 192 -29.25,-4.1; 193 -29.55,4.1; 194 -29.85,-4.1; 195 -30.15,4.1; 196 -30.45,-4.1; 197 -30.75,4.1; 198 -31.05,-4.1; 199 -31.35,4.1; 200 -31.65,-4.1 | smd 4.5 x 4.6: SH1 -32.55,-12; SH2 32.55,-12 | hole 1.1: -33.4,0 | hole 1.6: 33.4,0
MOLEX_0532610271 = smd 0.8 x 1.6: 1 0.625,0; 2 -0.625,0 | smd 2.1 x 3: 3 -3.175,-2.9; 4 3.175,-2.9
MOLEX_0532610671 = smd 0.8 x 1.6: 1 -3.125,0; 2 -1.875,0; 3 -0.625,0; 4 0.625,0; 5 1.875,0; 6 3.125,0 | smd 2.1 x 3: S1 -5.675,-2.9; S2 5.675,-2.9
IND_BOURNS_SRN4018 = smd 1.499 x 3.607: 1 -1.524,0; 2 1.524,0
R0402 = smd 0.5 x 0.5: 1 0,0.463; 2 0,-0.463
3,0-PAD = drill 3 pad 5.842: B3,0 0,0
SON45P300X300X80-13N = smd 0.8 x 0.25: 1 -1.5,1.125; 2 -1.5,0.675; 3 -1.5,0.225; 4 -1.5,-0.225; 5 -1.5,-0.675; 6 -1.5,-1.125; 7 1.5,-1.125; 8 1.5,-0.675; 9 1.5,-0.225; 10 1.5,0.225; 11 1.5,0.675; 12 1.5,1.125 | smd 1.75 x 2.65: 13 0,0
FCI_10051922-1510ELF = smd 0.305 x 0.813: 1 3.505,-2.108; 2 2.997,-2.108; 3 2.489,-2.108; 4 2.007,-2.108; 5 1.499,-2.108; 6 0.991,-2.108; 7 0.508,-2.108; 8 0,-2.108; 9 -0.508,-2.108; 10 -0.991,-2.108; 11 -1.499,-2.108; 12 -2.007,-2.108; 13 -2.489,-2.108; 14 -2.997,-2.108; 15 -3.505,-2.108 | smd 0.965 x 1.016: 16 -4.699,0.584; 17 4.699,0.584
SOT65P210X110-5N = smd 1.168 x 0.457: 1 -1.041,0.66; 2 -1.041,0; 3 -1.041,-0.66; 4 1.041,-0.66; 5 1.041,0.66
TSSOP16 = smd 0.4 x 1.6: 1 -2.225,-2.85; 2 -1.575,-2.85; 3 -0.925,-2.85; 4 -0.275,-2.85; 5 0.375,-2.85; 6 1.025,-2.85; 7 1.675,-2.85; 8 2.325,-2.85; 9 2.325,3.05; 10 1.675,3.05; 11 1.025,3.05; 12 0.375,3.05; 13 -0.275,3.05; 14 -0.925,3.05; 15 -1.575,3.05; 16 -2.225,3.05

### Placement (x,y rotation side)
C1  63.25,74.93 90 top
C2  74.68,78.36 180 top
C3  74.68,75.31 180 top
C4  76.71,50.29 0 top
C6  63.25,65.53 180 top
C7  73.66,65.79 0 top
C8  8.64,49.53 90 top
C9  14.22,49.53 270 top
C10  76.71,55.37 0 top
C11  11.43,46.74 180 top
C12  4.06,45.97 0 top
C13  54.1,45.72 270 top
C14  4.06,50.04 0 top
C15  18.29,51.82 180 top
C16  58.55,45.72 270 top
C17  76.96,33.53 180 top
C18  14.99,67.82 90 top
C19  34.16,50.75 270 top
C20  34.16,48.79 270 top
C21  36.83,53.09 180 top
C22  34.16,46.74 270 top
C23  41.66,53.09 180 top
D1  40.64,73.66 90 top
D2  50.8,73.66 90 top
D3  19.3,70.87 90 top
EDGE1  91.44,0 0 bottom
F1  76.71,60.71 90 top
FB1  45.72,73.66 180 top
FB2  55.88,73.66 180 top
FB3  14.99,72.64 180 top
FRAME1  13.72,9.65 0 top
H1  13.97,81.92 0 top
H2  13.97,87 0 top
J1  81.53,41.91 90 top
J3  81.53,54.61 90 top
J4  38.1,38.1 0 top
J5  81.53,78.74 90 top
J6  81.53,15.24 90 top
J7  81.53,29.21 90 top
J8  9.65,66.8 270 top
J9  81.53,67.31 90 top
L1  63.25,69.85 0 top
L2  73.41,69.85 180 top
LOGO1  44.45,54.61 0 top
LOGO2  20.32,54.61 0 top
R1  63.25,77.47 180 top
R3  69.85,60.45 90 top
R4  69.85,59.18 90 top
R5  65.66,31.11 180 top
R6  40.64,31.11 180 top
R7  63.37,31.24 270 top
R8  42.55,31.11 180 top
R9  63.37,29.97 270 top
STD1  68.9,11.1 0 top
STD2  7.3,11.1 0 top
U1  68.33,76.2 180 top
U2  59.71,52.89 180 bottom
U3  11.43,49.53 180 top
U4  57.66,19.05 0 bottom
U5  3.56,57.5 270 bottom
U7  39.12,49.02 270 top

### Tracks (layer width: path | path; a pad name or v marks a point on that pad's centre or on a via)
1.8V  (via drill 0.3)
  Top 0.254: U1.10 66.32,75.97
  Top 0.305: v74.93,72.9 L2.1 74.93,65.81 C7.2 74.95,64.54 72.39,61.98 v72.14,61.98 | v69.6,73.15 68.94,73.81 66.55,73.81 66.12,74.24 66.12,75.77 66.32,75.97 | 10.95,34.3 J4.185 J4.183 11.55,43.55 16.99,49 C15.2 16.99,55.52 25.98,64.52 v59.94,64.52 | 10.95,34.3 J4.184 | J4.186 10.95,34.3
  Bottom 0.305: v74.93,72.9 74.68,73.15 v69.6,73.15 | v72.14,61.98 62.74,61.98 60.2,64.52 v59.94,64.52
2V5
  Top 0.305: J4.190 9.45,39.45 9.75,39.75 J4.189 9.75,46.74 | 9.75,46.74 9.75,48.23 U3.5 | C11.2 9.75,46.74
3.3V  (via drill 0.3, 0.51)
  Top 0.254: R9.1 R7.1 64.17,31.58 R5.2 66.88,31.58 68.33,33.02 68.25,33.1 J4.6 68.45,34.2 68.45,34.4 J4.4 68.56,34.3 68.56,35.81 71.56,35.81 73.66,33.65 73.78,33.53 C17.2 | 71.47,60.78 71.47,59.69 | 71.47,59.69 71.47,50.27 | 69.66,48.45 64.52,53.59 v56.39,53.59 55.37,54.61 43.68,54.61 C23.1 U7.16 | 66.42,45.22 75.43,45.22 76.2,44.45 | R3.2 70.31,59.69 | 70.31,59.69 R4.2 | 71.47,59.69 70.31,59.69
  Top 0.305: U1.4 70.84,76.42 v70.87,76.45 | v61.72,73.41 L1.1 61.72,66.21 C6.2 | U3.3 11.89,50.19 11.58,49.88 11.58,49.17 11.89,48.87 U3.1 13.31,48.87 13.47,49.03 C9.2 14.67,49.48 14.7,49.48 14.88,49.65 14.88,50.91 11.56,54.23 | J4.191 J4.193 | J4.193 8.55,34.3 | 8.55,34.3 J4.194 | 8.55,34.3 J4.192 | J4.42 53.85,36.07 v54.1,36.32 | v54.1,39.88 54.15,39.93 J4.41 54.15,45.17 C13.2 C16.2 | v58.42,39.88 58.35,39.95 J4.39 58.35,45.02 C16.2 | v58.42,36.32 58.42,35.38 58.05,35.01 J4.40 | C6.2 22.86,65.53 11.56,54.23 | 7.93,50.04 7.93,45.91 8.55,45.29 J4.193 | 7.93,50.04 7.93,50.6 11.56,54.23 | 71.47,60.78 69.51,62.74 64.43,62.74 62.12,65.04 C6.2 | 71.47,50.27 69.66,48.45 66.42,45.22 C16.2 | v73.66,32.51 73.66,33.65 76.2,36.12 v76.2,40.13 | C14.2 7.93,50.04 | 76.2,44.45 v76.2,43.18
  Bottom 0.254: U2.15 56.21,53.77 v56.39,53.59
  Bottom 0.305: v70.87,76.45 68.07,73.66 61.98,73.66 v61.72,73.41 | v54.1,36.32 v54.1,39.88 | v58.42,39.88 v58.42,36.32 | U4.15 66.75,16.94 73.66,23.85 v73.66,32.51 | v76.2,43.18 v76.2,40.13
5V  (via drill 0.3, 0.36)
  Top 0.254: 1.03,54.5 1.05,54.48 1.02,54.48 | 1.02,57.91 1.05,58.12 1.05,58.19 1.02,58.42
  Top 0.305: 67.56,78.36 69.83,78.36 | 69.83,78.36 U1.6 | 67.56,78.36 67.56,78.32 66.83,77.58 U1.7 63.85,77.33 R1.2 | 67.56,78.36 67.56,80.01 | C2.2 69.83,78.36 | v70.1,73.91 69.83,74.19 U1.1 | v72.14,74.93 72.52,75.31 C3.2 | J4.200 6.75,34.3 J4.198 | v4.6,54.51 1.04,54.51 1.03,54.5 1.02,54.48 | J1.1 83.22,40.03 83.31,40.13 83.31,43.94 78,49.25 C4.2 78,51.79 75.41,54.38 C10.1 74.93,55.37 73.91,56.39 73.91,62.23 74.49,62.81 F1.2
  Top 0.508: 78.77,73.91 73.66,73.91 73.38,74.19 C3.2 | J4.197 7.11,42.2 | 7.11,42.2 J4.199 | 7.11,42.2 7.11,43.43 5.36,45.19 C12.2 3.33,48.01 1.55,48.01 1.02,48.54 1.02,54.48 1.02,57.91 | 6.75,34.3 6.75,40.61 7.01,40.87 7.01,42.1 7.11,42.2 | 1.02,58.42 1.02,69.77 1.52,70.28 1.52,72.14 12.6,83.21 17.75,83.21 H1.47 20.95,80.01 67.56,80.01 76.92,80.01 76.94,80.03 77.7,80.03 78.77,78.97 78.77,73.91 | F1.2 76.71,63.25 78.77,65.3 78.77,73.91
  Bottom 0.254: U5.2 v4.6,54.5 v4.6,54.51
  Bottom 0.305: v70.1,73.91 71.12,73.91 v72.14,74.93
A@W_5V0  (via drill 0.65)
  Top 0.254: J7.1 82.96,27.34 83.57,27.94
  Top 0.305: 83.57,27.94 82.92,28.59 J7.2
  Top 0.508: D2.C 54.81,71.45 | 54.81,71.45 FB2.1 | v58.93,68.58 57.68,68.58 54.81,71.45 | 83.57,27.94 88.9,33.27 88.9,47.24 v87.38,48.77
  Bottom 0.508: v87.38,48.77 67.82,68.33 59.18,68.33 v58.93,68.58
ADCS_3V3  (via drill 0.65)
  Top 0.508: D1.C 44.4,71.45 | FB1.1 44.4,71.45 | 44.4,71.45 43.43,72.42 v43.43,73.66 | J5.1 v79.89,79.36
  Bottom 0.508: v43.43,73.66 43.43,78.23 44.57,79.36 v79.89,79.36
C1+
  Top 0.203: U7.1 C19.1
C1-
  Top 0.152: C19.2 34.84,50.25
  Top 0.203: U7.3 35.14,49.95 34.84,50.25
C2+
  Top 0.203: U7.4 C20.1
C2-
  Top 0.203: U7.5 35.19,48.65 34.8,48.26 34.2,48.26 C20.2
CAM0_C_N  (via drill 0.25)
  Top 0.203: J4.144 23.25,32.66 23.36,32.54 23.36,29.83 26.5,26.7 28.52,26.7 arc90 29.17,27.34 arc-90 29.46,27.64 29.54,27.64 arc-90 29.83,27.34 arc90 30.48,26.7 arc90 31.13,27.34 arc-90 31.42,27.64 31.64,27.64 arc-90 31.93,27.34 arc90 32.58,26.7 51.24,26.7 56.23,21.7 57.73,20.2 57.73,18.03 v57.61,18.03
  Bottom 0.203: U4.8 57.66,17.45 57.73,17.53 57.73,18.03 v57.61,18.03
CAM0_C_P  (via drill 0.25)
  Top 0.203: J4.142 23.85,32.67 23.72,32.54 23.72,30 26.67,27.05 28.52,27.05 arc90 28.81,27.34 arc-90 29.46,27.99 29.54,27.99 arc-90 30.19,27.34 arc90 30.48,27.05 arc90 30.77,27.34 arc-90 31.42,27.99 31.64,27.99 arc-90 32.29,27.34 arc90 32.58,27.05 51.39,27.05 56.59,21.85 58.09,20.34 58.09,18.03 v58.22,18.03
  Bottom 0.203: U4.9 58.17,17.45 58.09,17.53 58.09,18.03 v58.22,18.03
CAM0_D0_N  (via drill 0.25)
  Top 0.203: J4.138 25.05,32.86 25.19,32.73 25.19,30.43 arc90 25.19,30.43 26.13,29.49 30.25,29.49 arc90 30.9,30.14 30.9,30.28 arc-90 31.2,30.57 31.37,30.57 arc-90 31.66,30.28 31.66,30.14 arc90 32.31,29.49 32.49,29.49 arc90 33.14,30.14 33.14,30.27 arc-90 33.43,30.57 33.6,30.57 arc-90 33.9,30.27 33.9,30.14 arc90 34.54,29.49 53.31,29.49 54.74,28.07 54.74,26.42 v54.61,26.42
  Bottom 0.203: U4.2 54.66,17.45 54.74,17.53 54.74,26.42 v54.61,26.42
CAM0_D0_P  (via drill 0.25)
  Top 0.203: J4.136 25.65,32.83 25.55,32.73 25.55,30.58 arc90 25.55,30.57 26.27,29.85 30.25,29.85 arc90 30.55,30.14 30.55,30.28 arc-90 31.2,30.93 31.37,30.93 arc-90 32.02,30.28 32.02,30.14 arc90 32.31,29.85 32.49,29.85 arc90 32.78,30.14 32.78,30.28 arc-90 33.43,30.93 33.6,30.93 arc-90 34.25,30.28 34.25,30.14 arc90 34.54,29.85 53.46,29.85 55.09,28.22 55.09,26.42 v55.22,26.42
  Bottom 0.203: U4.3 55.17,17.45 55.09,17.53 55.09,26.42 v55.22,26.42
CAM0_D1_N  (via drill 0.25)
  Top 0.203: J4.150 21.45,32.4 21.59,32.26 21.59,25.82 23.65,23.76 51.84,23.76 56.24,19.36 56.24,18.03 v56.11,18.03
  Bottom 0.203: U4.5 56.16,17.42 56.24,17.5 56.24,18.03 v56.11,18.03
CAM0_D1_P  (via drill 0.25)
  Top 0.203: J4.148 22.05,32.36 21.95,32.26 21.95,25.97 23.8,24.12 51.98,24.12 56.59,19.51 56.59,18.03 v56.72,18.03
  Bottom 0.203: U4.6 56.67,17.42 56.59,17.5 56.59,18.03 v56.72,18.03
CAM0_IO0  (via drill 0.3)
  Top 0.203: J4.36 v59.25,20.54
  Bottom 0.203: v59.25,20.54 59.25,17.76 59.13,17.64 59.13,16.97 U4.11
CAM0_IO1  (via drill 0.3)
  Top 0.203: v59.86,19.99 59.86,33.99 J4.34
  Bottom 0.203: U4.12 59.66,19.79 v59.86,19.99
CAM1_C_N  (via drill 0.25)
  Top 0.203: J4.149 21.75,43.29 21.89,43.43 21.89,44.27 23.23,45.6 arc-90 24.15,45.6 24.25,45.5 arc90 24.67,45.5 24.68,45.51 arc90 24.68,45.92 24.57,46.03 arc-90 24.57,46.95 24.59,46.96 arc-90 25.5,46.96 25.61,46.85 arc90 26.02,46.85 26.04,46.87 arc90 26.04,47.28 25.93,47.39 arc-90 25.93,48.3 25.94,48.32 arc-90 26.86,48.32 26.87,48.31 arc90 27.28,48.31 27.3,48.32 arc90 27.3,48.73 27.29,48.74 arc-90 27.29,49.66 27.3,49.67 arc-90 28.22,49.67 arc90 28.63,49.67 28.64,49.69 arc90 28.64,50.1 arc-90 28.64,51.02 28.66,51.03 arc-90 29.57,51.03 arc90 29.99,51.03 30,51.05 arc90 30,51.46 arc-90 30,52.37 30.01,52.39 arc-90 30.93,52.39 arc90 31.34,52.39 31.36,52.4 arc90 31.36,52.81 arc-90 31.36,53.73 31.37,53.74 arc-90 32.29,53.74 32.39,53.64 arc90 32.81,53.64 32.82,53.65 arc90 32.82,54.06 32.71,54.17 arc-90 32.71,55.09 34.7,57.07 45.15,57.07 arc-90 45.8,56.43 arc90 46.09,56.13 46.2,56.13 arc90 46.49,56.43 arc-90 47.14,57.07 47.25,57.07 arc-90 47.9,56.43 arc90 48.19,56.13 48.3,56.13 arc90 48.6,56.43 arc-90 49.24,57.07 49.36,57.07 arc-90 50,56.43 arc90 50.3,56.13 50.41,56.13 arc90 50.7,56.43 arc-90 51.35,57.07 51.46,57.07 arc-90 52.11,56.43 arc90 52.4,56.13 52.51,56.13 arc90 52.8,56.43 arc-90 53.45,57.07 53.56,57.07 arc-90 54.21,56.43 arc90 54.5,56.13 54.62,56.13 arc90 54.91,56.43 arc-90 55.55,57.07 55.67,57.07 arc-90 56.31,56.43 arc90 56.61,56.13 56.72,56.13 arc90 57.01,56.43 arc-90 57.66,57.07 59.28,57.07 59.64,56.72 59.64,56.13 v59.77,56.13
  Bottom 0.203: U2.8 59.71,55.5 59.64,55.58 59.64,56.13 v59.77,56.13
CAM1_C_P  (via drill 0.25)
  Top 0.203: J4.147 22.35,43.33 22.25,43.43 22.25,44.12 23.48,45.35 arc-90 23.89,45.35 24,45.24 arc90 24.92,45.24 24.93,45.26 arc90 24.93,46.17 24.82,46.28 arc-90 24.82,46.7 24.84,46.71 arc-90 25.25,46.71 25.36,46.6 arc90 26.27,46.6 26.29,46.62 arc90 26.29,47.53 26.18,47.64 arc-90 26.18,48.05 26.2,48.07 arc-90 26.61,48.07 26.72,47.96 arc90 27.63,47.96 27.65,47.97 arc90 27.65,48.89 27.54,49 arc-90 27.54,49.41 27.55,49.42 arc-90 27.96,49.42 28.07,49.31 arc90 28.99,49.31 29,49.33 arc90 29,50.24 28.89,50.35 arc-90 28.89,50.77 28.91,50.78 arc-90 29.32,50.78 29.43,50.67 arc90 30.35,50.67 30.36,50.69 arc90 30.36,51.6 30.25,51.71 arc-90 30.25,52.12 30.27,52.14 arc-90 30.68,52.14 30.79,52.03 arc90 31.7,52.03 31.72,52.04 arc90 31.72,52.96 31.61,53.07 arc-90 31.61,53.48 31.62,53.49 arc-90 32.03,53.49 32.14,53.38 arc90 33.06,53.38 33.07,53.4 arc90 33.07,54.31 32.96,54.42 arc-90 32.96,54.84 34.85,56.72 45.15,56.72 arc-90 45.44,56.43 arc90 46.09,55.78 46.2,55.78 arc90 46.85,56.43 arc-90 47.14,56.72 47.25,56.72 arc-90 47.54,56.43 arc90 48.19,55.78 48.3,55.78 arc90 48.95,56.43 arc-90 49.24,56.72 49.36,56.72 arc-90 49.65,56.43 arc90 50.3,55.78 50.41,55.78 arc90 51.05,56.43 arc-90 51.35,56.72 51.46,56.72 arc-90 51.75,56.43 arc90 52.4,55.78 52.51,55.78 arc90 53.16,56.43 arc-90 53.45,56.72 53.56,56.72 arc-90 53.85,56.43 arc90 54.5,55.78 54.62,55.78 arc90 55.26,56.43 arc-90 55.55,56.72 55.67,56.72 arc-90 55.96,56.43 arc90 56.61,55.78 56.72,55.78 arc90 57.37,56.43 arc-90 57.66,56.72 59.13,56.72 59.28,56.57 59.28,56.13 v59.16,56.13
  Bottom 0.203: U2.9 59.21,55.5 59.28,55.58 59.28,56.13 v59.16,56.13
CAM1_D0_N  (via drill 0.25)
  Top 0.203: J4.161 18.15,43.4 18.26,43.51 18.26,44.78 34.62,61.14 54.42,61.14 arc90 54.72,61.43 54.72,62.15 arc-90 55.36,62.8 55.7,62.8 arc-90 56.34,62.15 56.34,62.02 arc90 56.64,61.72 56.97,61.72 arc90 57.26,62.02 57.26,62.15 arc-90 57.91,62.8 58.24,62.8 arc-90 58.89,62.15 58.89,61.43 arc90 59.18,61.14 59.51,61.14 62.64,58.01 62.64,56.39 v62.76,56.39
  Bottom 0.203: U2.2 62.71,55.58 62.64,55.65 62.64,56.39 v62.76,56.39
CAM1_D0_P  (via drill 0.25)
  Top 0.203: J4.159 18.75,43.38 18.62,43.51 18.62,44.63 34.77,60.78 54.42,60.78 arc90 55.07,61.43 55.07,62.15 arc-90 55.36,62.44 55.7,62.44 arc-90 55.99,62.15 55.99,61.43 arc90 56.64,60.78 56.97,60.78 arc90 57.62,61.43 57.62,62.15 arc-90 57.91,62.44 58.24,62.44 arc-90 58.53,62.15 58.53,61.43 arc90 59.18,60.78 59.36,60.78 62.28,57.86 62.28,56.39 v62.15,56.39
  Bottom 0.203: U2.3 62.2,55.57 62.28,55.65 62.28,56.39 v62.15,56.39
CAM1_D1_N  (via drill 0.25)
  Top 0.203: J4.155 19.95,43.39 20.07,43.51 20.07,44.45 34.72,59.11 38.35,59.11 arc90 38.65,59.4 38.65,59.45 arc-90 39.29,60.1 40.8,60.1 arc-90 41.45,59.45 41.45,58.41 arc90 41.74,58.11 43.25,58.11 arc90 43.54,58.41 43.54,59.45 arc-90 44.19,60.1 45.7,60.1 arc-90 46.35,59.45 46.35,58.41 arc90 46.64,58.11 48.15,58.11 arc90 48.44,58.41 48.44,59.45 arc-90 49.09,60.1 50.6,60.1 arc-90 51.25,59.45 51.25,58.99 arc90 51.54,58.7 53.05,58.7 arc90 53.34,58.99 53.34,59.45 arc-90 53.99,60.1 55.5,60.1 arc-90 56.14,59.45 56.14,59.4 arc90 56.44,59.11 59.26,59.11 61.14,57.22 61.14,56.39 v61.27,56.39
  Bottom 0.203: U2.5 61.21,55.55 61.14,55.63 61.14,56.39 v61.27,56.39
CAM1_D1_P  (via drill 0.25)
  Top 0.203: J4.153 20.55,43.38 20.42,43.51 20.42,44.3 34.87,58.75 38.35,58.75 arc90 39,59.4 39,59.45 arc-90 39.29,59.74 40.8,59.74 arc-90 41.09,59.45 41.09,58.41 arc90 41.74,57.76 43.25,57.76 arc90 43.9,58.41 43.9,59.45 arc-90 44.19,59.74 45.7,59.74 arc-90 45.99,59.45 45.99,58.41 arc90 46.64,57.76 48.15,57.76 arc90 48.8,58.41 48.8,59.45 arc-90 49.09,59.74 50.6,59.74 arc-90 50.89,59.45 50.89,58.41 arc90 51.54,57.76 53.05,57.76 arc90 53.7,58.41 53.7,59.45 arc-90 53.99,59.74 55.5,59.74 arc-90 55.79,59.45 55.79,59.4 arc90 56.44,58.75 59.11,58.75 60.78,57.08 60.78,56.39 v60.66,56.39
  Bottom 0.203: U2.6 60.7,55.55 60.78,55.63 60.78,56.39 v60.66,56.39
CAM1_IO0  (via drill 0.25)
  Top 0.203: v64.77,43.94 64.95,43.76 J4.17
  Bottom 0.203: U2.11 58.22,50.5 v64.77,43.94
CAM1_IO1  (via drill 0.25)
  Top 0.203: J4.15 65.35,42.4 65.35,44.01 64.91,44.45 v63.25,44.45
  Bottom 0.203: U2.12 57.71,50.16 63.25,44.62 v63.25,44.45
CD0_SCL  (via drill 0.3)
  Top 0.152: v60.98,31.72 62.73,29.97 R9.2
  Top 0.203: J4.30 61.05,31.78 v60.98,31.72
  Bottom 0.203: v60.98,31.72 v60.99,31.72 60.96,19.81 60.22,19.07 60.22,18.03 60.15,17.96 U4.13
CD0_SDA  (via drill 0.3)
  Top 0.152: v61.69,31.8 62.25,31.24 R7.2
  Top 0.203: v61.69,31.8 61.65,31.85 J4.28
  Bottom 0.203: U4.14 60.76,17.04 60.76,18.98 61.44,19.66 61.44,31.55 v61.69,31.8
CD1_SCL  (via drill 0.25, 0.3)
  Top 0.152: v68.6,44.18 68.55,44.12 J4.5 | R4.1 v66.8,59.18
  Bottom 0.127: 57.23,55.7
  Bottom 0.152: v68.6,44.18 68.6,57.38 v66.8,59.18 60.71,59.18 57.23,55.7 | 57.23,55.7 U2.13
CD1_SDA  (via drill 0.25, 0.3)
  Top 0.127: 69.34,60.45 R3.1
  Top 0.152: J4.3 69.15,44.09 v69.26,44.2 | v67.31,59.69 68.58,59.69 69.34,60.45
  Bottom 0.127: 68.33,58.67 v67.31,59.69
  Bottom 0.152: 68.33,58.67 69.26,57.74 v69.26,44.2 | U2.14 56.72,55.84 60.57,59.69 v67.31,59.69
EMMC_DISABLE_N
  Top 0.152: J4.2 69.45,32.83 68.79,31.7 68.71,31.58 67.79,30.65 R5.1
EN2  (via drill 0.3)
  Top 0.305: C1.2 63.25,76.2 | 63.25,76.2 R1.1 | 63.25,76.2 v63.88,76.2 | v66.83,74.42 U1.12
  Bottom 0.305: v63.88,76.2 65,76.2 66.83,74.37 v66.83,74.42
EPS_OUT2
  Top 0.508: H1.49 19.68,78.74 47.93,78.74 D2.A 54.81,75.87 FB2.2
EPS_OUT4  (via drill 0.65)
  Top 0.508: D3.A 19.13,72.9 17.53,72.9 16.89,73.53 FB3.2 v14.99,75.18
  Bottom 0.508: H1.48 20.32,83.19 20.32,80.52 v14.99,75.18
EPS_OUT5  (via drill 0.65)
  Top 0.254: J6.2 80.38,13.37 79.94,12.88 v79.76,12.7 80.34,12.12 J6.1
  Bottom 0.508: H1.50 15.21,85.75 2.95,85.75 1.52,84.33 1.52,70.28 1.02,69.77 1.02,36.58 31.34,6.25 75.08,6.25 78.99,10.16 78.99,11.94 v79.76,12.7
EPS_OUT6  (via drill 0.65)
  Top 0.508: v14.48,77.47 39.62,77.47 40.64,76.45 D1.A 44.4,75.87 FB1.2
  Bottom 0.508: H1.52 11.56,84.45 10.92,83.82 10.92,81.03 v14.48,77.47
GND  (via drill 0.25, 0.3, 0.65, 3.1 pad 5.08)
  Top 0.254: U1.3 68.55,75.97 | J4.1 69.75,41.09 69.3,40.64 v68.58,40.64
  Top 0.305: 68.55,75.97 U1.13 | U1.13 68.1,76.42 U1.9 | v67.77,74.47 67.77,75.13 67.79,75.16 67.82,75.13 67.82,75.08 68.33,75.59 U1.13
  Bottom 0.254: U4.4 55.73,16.87 55.73,16.42 55.89,16.26 56.94,16.26 57.1,16.42 57.1,16.89 U4.7 57.23,16.87 57.23,16.42 57.39,16.26 58.43,16.26 58.6,16.42 58.6,16.89 U4.10
  other vias: 11.43,48.01 14.48,48.01 10.92,44.7 12.19,39.62 12.19,36.45 22.35,36.45 18.54,39.62 22.35,40.39 8.89,48.01 13.34,51.18 77.22,78.36 77.22,75.31 63.25,73.03 53.04,40.18 59.89,40.44 54.05,47.29 59.64,46.53 57.15,16.18 64.01,60.71 86.11,56.9 77.22,67.31 71.12,66.55 66.29,66.04 49.53,50.8 71.37,42.42 80.52,57.66 11.18,65.02 11.18,76.96 79.76,16.26 83.57,30.48 79.76,43.69 85.34,43.69 83.31,78.23 35.51,52.37 40.77,53.72
  pour Top (isolate 0.127): -1.91,98.42 95.25,98.42 95.25,-1.27 -2.54,-1.27 -2.54,98.42
  pour Route2 (isolate 1.016): -7.37,101.35 99.82,101.35 99.82,-4.06 -7.37,-4.06
  pour Route15 (isolate 1.016): -5.84,99.82 97.28,99.82 97.79,99.31 97.79,-2.79 -5.84,-2.79
  pour Bottom (isolate 0.127): -4.06,99.31 97.03,99.31 97.03,-1.78 96.77,-2.03 -4.57,-2.03 -4.83,-1.78 -4.83,99.31
GPIO44
  Top 0.203: J4.82 41.85,32.27 R8.2
GPIO45
  Top 0.203: R6.2 41.25,32.19 J4.84
HSI_DEBUG_V
  Top 0.508: F1.1 81.35,58.61 83.57,56.39 83.57,53.34 82.96,52.73 J3.1
LX1
  Top 0.254: U1.8 66.26,76.88 64.77,75.39
  Top 0.305: 64.77,75.39 L1.2
LX2
  Top 0.254: U1.2 70.26,75.53
  Top 0.305: L2.2 71.88,73.9 70.26,75.53
N$6
  Top 0.305: U3.4 10.23,50.03 C8.2
RC_3V3
  Top 0.508: J8.1 14.98,68.68 C18.2 | C18.2 D3.C | C18.2 FB3.1
RXD0_DEBUG
  Top 0.152: J3.3 81.42,55.12 80.77,55.12 80.14,54.48 80.14,51.18 83.7,47.61 86.24,47.61 87.63,46.23 87.63,40.64 86.36,39.37 78.22,39.37 76.57,41.02 75.83,41.02 75.31,40.5 75.31,39.43 72.85,36.97 71.03,36.97 70.89,37.11 49.41,37.11 48.67,36.37 48.67,34.22 J4.60
SCL_OBC  (via drill 0.25)
  Top 0.127: J4.65 46.99,42.16 v46.99,40.13 | v70.87,33.53 70.87,33.15 73.15,30.86 73.15,28.96 80.26,21.84 80.26,18.62 80.52,18.36 J6.6 | J9.2 82.43,66.69 v82.8,67.06 82.8,69.19 J9.4
  Top 0.152: v8.38,68.07 8.38,66.55 8.89,66.04 9.52,66.04 J8.3 | v46.99,43.69 46.99,42.24 J4.65
  Bottom 0.127: v46.99,40.13 53.59,33.53 v70.87,33.53 70.87,34.04 76.11,39.28 79.24,39.28 88.39,48.43 88.39,62.84 85.58,65.66 84.2,65.66 v82.8,67.06
  Bottom 0.152: v8.38,68.07 10.29,68.07 H1.43 24.14,81.92 25.41,83.19 27.3,83.19 27.89,82.6 27.89,81.95 46.66,63.18 46.66,45.03 46.99,44.7 v46.99,43.69
SDA_OBC  (via drill 0.25)
  Top 0.127: v70.36,34.04 70.36,33.27 72.9,30.73 72.9,28.85 80.01,21.74 80.01,17.72 80.61,17.11 J6.5 | J4.63 47.55,40.33 v47.75,40.13 | J9.3 80.38,67.94 80.26,67.82 80.26,65.53 80.36,65.44 J9.1 81.56,65.41 v83.08,65.41
  Top 0.152: J8.2 10.56,67.43 v11.07,67.94 | v46.51,44.45 46.84,44.12 47.17,44.12 47.55,43.74 J4.63
  Bottom 0.127: v47.75,40.13 53.85,34.04 v70.36,34.04 75.86,39.53 79.14,39.53 88.14,48.53 88.14,62.74 85.47,65.41 v83.08,65.41
  Bottom 0.152: v46.51,44.45 46.38,44.58 46.38,63.07 27.53,81.92 H1.41 25.4,80.64 23.25,80.64 11.07,68.46 v11.07,67.94
STS_CTS
  Top 0.203: U7.10 45.87,47.35 49.35,43.87 J4.57
STS_CTS_232  (via drill 0.25)
  Top 0.152: U7.7 36.9,47.34 38.41,48.85 38.41,54.54 v37.59,55.63
  Bottom 0.152: U5.12 5.82,59.35 33.76,59.35 v37.59,55.63
STS_EXT_RESET  (via drill 0.25)
  Top 0.152: v45.75,45.35 J4.69
  Bottom 0.152: U5.6 32.39,56.51 33.85,55.05 43.11,55.05 45.75,52.41 v45.75,45.35
STS_EXT_TRG_IN  (via drill 0.25)
  Top 0.152: v45.16,45.41 45.16,42.21 J4.71
  Bottom 0.152: v45.16,45.41 45.16,52.12 42.93,54.36 33.78,54.36 32.26,55.88 10.43,55.88 7.42,52.88 4.53,52.88 3.86,53.55 3.86,58.04 4.79,58.97 5.64,58.97 U5.11
STS_RTS
  Top 0.203: U7.9 45.51,46.7 48.75,43.45 J4.59
STS_RTS_232  (via drill 0.25)
  Top 0.152: U7.8 36.23,46.73 33.78,46.73 33.27,47.24 33.27,51.61 34.87,53.2 34.87,53.66 v36.83,55.63
  Bottom 0.152: v36.83,55.63 36.83,55.77 34.59,58.01 U5.9
STS_RX
  Top 0.203: U7.11 47.25,48 51.15,44.1 J4.51
STS_RX_232  (via drill 0.25)
  Top 0.152: v39.12,55.63 40.13,54.61 40.13,50.55 40.73,49.95 U7.14
  Bottom 0.152: U5.14 5.82,60.34 34.4,60.34 v39.12,55.63
STS_TX  (via drill 0.25)
  Top 0.203: U7.12 47.73,48.65 50.04,46.34 v50.04,46.23 | v50.04,44.45 50.55,43.94 J4.53
  Bottom 0.203: v50.04,46.23 v50.04,44.45
STS_TX_232  (via drill 0.25)
  Top 0.152: U7.13 41.92,49.54 40.74,49.54 39.85,50.43 39.85,54.13 v38.35,55.63
  Bottom 0.152: U5.13 33.99,59.99 v38.35,55.63
TXD0_DEBUG
  Top 0.152: J3.2 80.66,53.98 80.5,53.84 80.5,51.24 83.85,47.89 86.36,47.89 87.91,46.34 87.91,40.52 86.48,39.09 78.1,39.09 76.45,40.74 75.95,40.74 75.59,40.38 75.59,39.08 73.2,36.69 70.92,36.69 70.78,36.83 49.53,36.83 49.05,36.35 J4.58
USB_D_N
  Top 0.254: J4.167 16.35,40.98 16.46,40.87 16.46,39.54 18.1,37.9 27.63,37.9 arc90 28.35,38.62 28.35,39.14 arc-90 28.67,39.45 28.91,39.45 arc-90 29.22,39.14 29.22,38.62 arc90 29.95,37.9 30.18,37.9 arc90 30.91,38.62 30.91,38.8 arc-90 31.22,39.11 31.46,39.11 arc-90 31.77,38.8 31.77,38.62 arc90 32.5,37.9 32.73,37.9 arc90 33.46,38.62 33.46,39.14 arc-90 33.78,39.45 34.01,39.45 arc-90 34.33,39.14 34.33,38.62 arc90 35.05,37.9 69.43,37.9 73.24,41.71 79.8,41.71 80.23,41.28 J1.2
USB_D_P
  Top 0.254: J4.165 16.95,40.95 16.87,40.87 16.87,39.71 18.27,38.3 27.63,38.3 arc90 27.95,38.62 27.95,39.14 arc-90 28.67,39.86 28.91,39.86 arc-90 29.63,39.14 29.63,38.62 arc90 29.95,38.3 30.18,38.3 arc90 30.5,38.62 30.5,39.14 arc-90 31.22,39.86 31.46,39.86 arc-90 32.18,39.14 32.18,38.62 arc90 32.5,38.3 32.73,38.3 arc90 33.05,38.62 33.05,39.14 arc-90 33.78,39.86 34.01,39.86 arc-90 34.73,39.14 34.73,38.62 arc90 35.05,38.3 69.26,38.3 73.07,42.11 79.8,42.11 80.23,42.53 J1.3
V+
  Top 0.203: U7.2 37.39,50.6 37.59,50.8 37.59,52.82 C21.1
V-
  Top 0.203: C22.1 34.68,47.75 35.05,47.75 35.31,48.01 36.26,48.01 U7.6

### Text on the board
tPlace: HSI / Motherboard